# Altium project CRIB.PrjPcb (part 1 of 2)
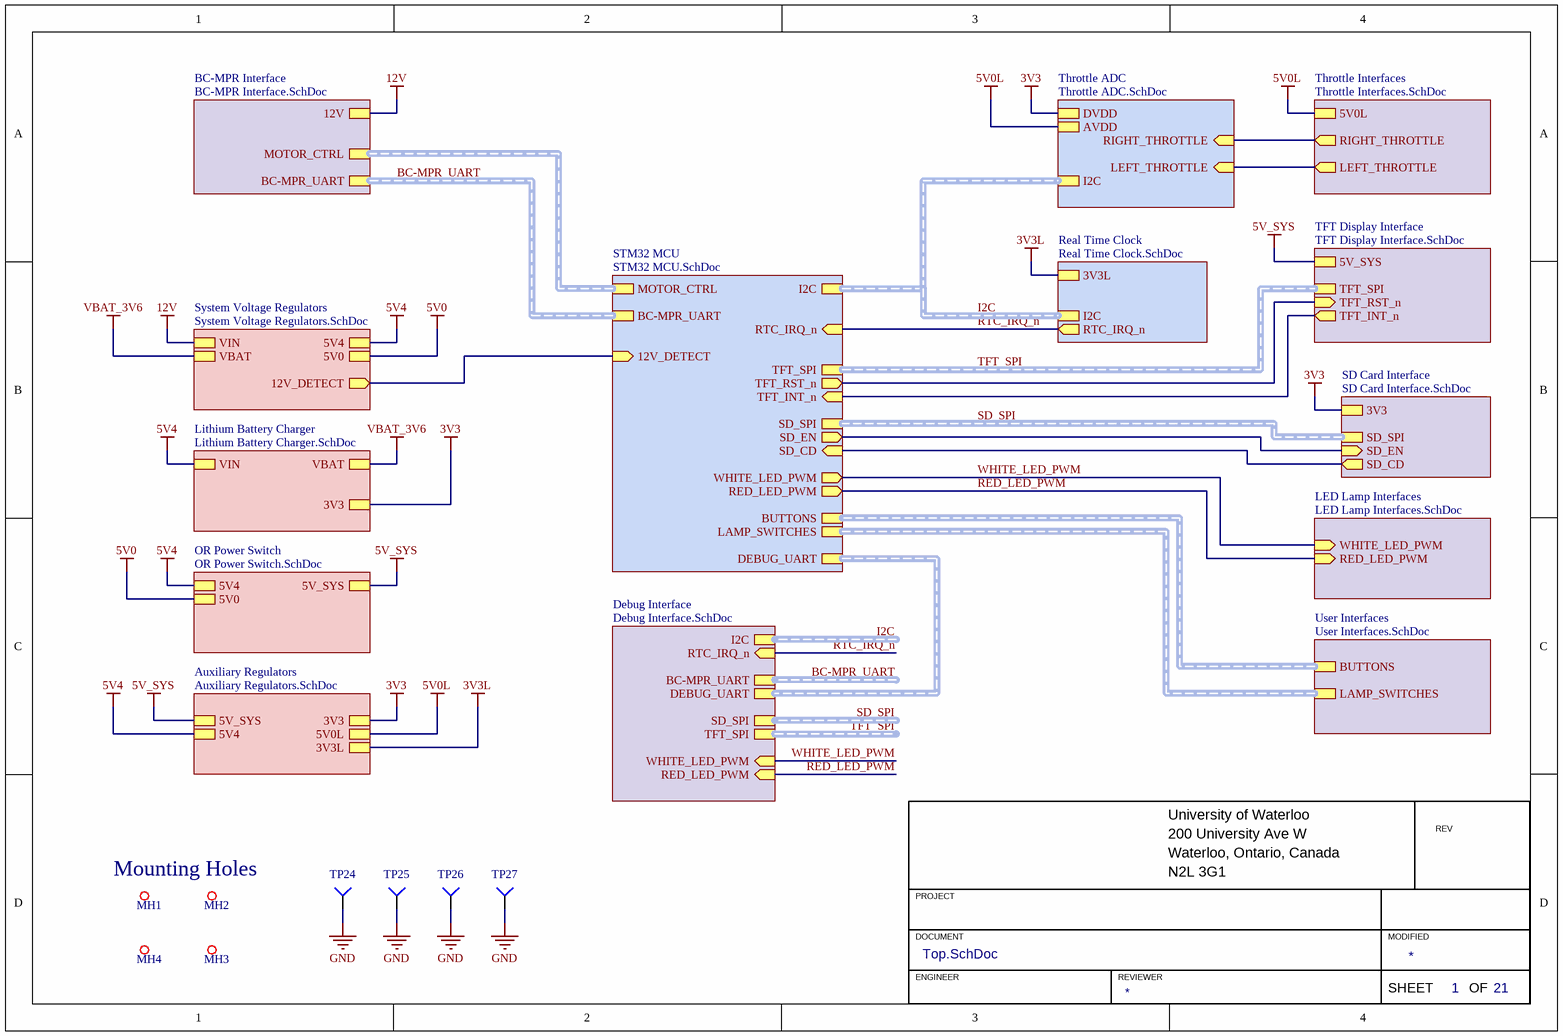
[diagram p0: Top.SchDoc]
21 sheets, 249 parts. Net scope: hierarchical (ports join the sheet entries above them; power ports are global).
Board file: CRIB.PcbDoc
Sheets:
  Top.SchDoc
    STM32 MCU = STM32 MCU.SchDoc
      MCU Power, Clock, & Debug = MCU Power Clock Debug.SchDoc
    TFT Display Interface = TFT Display Interface.SchDoc
    System Voltage Regulators = System Voltage Regulators.SchDoc
      Lithium Battery UVP Switch = Lithium Battery UVP Switch.SchDoc
    Lithium Battery Charger = Lithium Battery Charger.SchDoc
    BC-MPR Interface = BC-MPR Interface.SchDoc
    OR Power Switch = OR Power Switch.SchDoc
    Auxiliary Regulators = Auxiliary Regulators.SchDoc
    Throttle ADC = Throttle ADC.SchDoc
    Throttle Interfaces = Throttle Interfaces.SchDoc
    Real Time Clock = Real Time Clock.SchDoc
      I2C Buffer = I2C Buffer.SchDoc
    SD Card Interface = SD Card Interface.SchDoc
      PMOS Load Switch = PMOS Load Switch.SchDoc
    LED Lamp Interfaces = LED Lamp Interfaces.SchDoc
      Rear LED Driver = CC LED Driver.SchDoc
      Front LED Driver = CC LED Driver.SchDoc
    User Interfaces = User Interfaces.SchDoc
      Up Button Debounce = Debounce Filter.SchDoc
      Down Button Debounce = Debounce Filter.SchDoc
      Left Button Debounce = Debounce Filter.SchDoc
      Right Button Debounce = Debounce Filter.SchDoc
      Centre Button Debounce = Debounce Filter.SchDoc
      White Lamp Switch Debounce = Debounce Filter.SchDoc
      Red Lamp Switch Debounce = Debounce Filter.SchDoc
    Debug Interface = Debug Interface.SchDoc

## Sheet Top.SchDoc
size A4; Organization: TESLA Motors, INC; Address1: 3500 Deer Creek Road; Address2: Palo Alto, CA; Address4: U.S.A.; SheetNumber: 1; SheetTotal: 21

### Parts
MH1  MOUNTING_HOLE_M3  [MOUNTING_HOLE_3mm]  (value not drawn)  (no BOM)
MH2  MOUNTING_HOLE_M3  [MOUNTING_HOLE_3mm]  (value not drawn)  (no BOM)
MH3  MOUNTING_HOLE_M3  [MOUNTING_HOLE_3mm]  (value not drawn)  (no BOM)
MH4  MOUNTING_HOLE_M3  [MOUNTING_HOLE_3mm]  (value not drawn)  (no BOM)
TP24  TESTPOINT_KEYSTONE_LOOP  [KEYSTONE_5019]  (value not drawn)
TP25  TESTPOINT_KEYSTONE_LOOP  [KEYSTONE_5019]  (value not drawn)
TP26  TESTPOINT_KEYSTONE_LOOP  [KEYSTONE_5019]  (value not drawn)
TP27  TESTPOINT_KEYSTONE_LOOP  [KEYSTONE_5019]  (value not drawn)

### Sub-sheets
Auxiliary Regulators = Auxiliary Regulators.SchDoc: 5V_SYS, 3V3, 5V0L, 5V4, 3V3L
BC-MPR Interface = BC-MPR Interface.SchDoc: BC-MPR_UART (harness UART), MOTOR_CTRL (harness MOTOR CTRL), 12V
Debug Interface = Debug Interface.SchDoc: I2C (harness I2C), RTC_IRQ_n (in), BC-MPR_UART (harness UART), DEBUG_UART (harness UART), SD_SPI (harness SPI), TFT_SPI (harness SPI), WHITE_LED_PWM (in), RED_LED_PWM (in)
LED Lamp Interfaces = LED Lamp Interfaces.SchDoc: WHITE_LED_PWM (in), RED_LED_PWM (in)
Lithium Battery Charger = Lithium Battery Charger.SchDoc: VIN, VBAT, 3V3
OR Power Switch = OR Power Switch.SchDoc: 5V4, 5V0, 5V_SYS
Real Time Clock = Real Time Clock.SchDoc: I2C (harness I2C), 3V3L, RTC_IRQ_n (out)
SD Card Interface = SD Card Interface.SchDoc: SD_SPI (harness SPI), 3V3, SD_CD (out), SD_EN (in)
STM32 MCU = STM32 MCU.SchDoc: I2C (harness I2C), BC-MPR_UART (harness UART), MOTOR_CTRL (harness MOTOR CTRL), TFT_SPI (harness SPI), RTC_IRQ_n (in), SD_SPI (harness SPI), SD_CD (in), 12V_DETECT (in), WHITE_LED_PWM (out), RED_LED_PWM (out), DEBUG_UART (harness UART), TFT_RST_n (out), SD_EN (out), BUTTONS (harness BUTTONS), LAMP_SWITCHES (harness LAMP SWITCHES), TFT_INT_n (in)
System Voltage Regulators = System Voltage Regulators.SchDoc: VIN, 5V0, 5V4, VBAT, 12V_DETECT (out)
TFT Display Interface = TFT Display Interface.SchDoc: TFT_SPI (harness SPI), 5V_SYS, TFT_RST_n (in), TFT_INT_n (out)
Throttle ADC = Throttle ADC.SchDoc: I2C (harness I2C), DVDD, AVDD, RIGHT_THROTTLE (in), LEFT_THROTTLE (in)
Throttle Interfaces = Throttle Interfaces.SchDoc: RIGHT_THROTTLE (out), LEFT_THROTTLE (out), 5V0L
User Interfaces = User Interfaces.SchDoc: BUTTONS (harness BUTTONS), LAMP_SWITCHES (harness LAMP SWITCHES)

### Nets
3V3: sheet Lithium Battery Charger/3V3, sheet Auxiliary Regulators/3V3, sheet Throttle ADC/DVDD, sheet SD Card Interface/3V3
3V3L: sheet Auxiliary Regulators/3V3L, sheet Real Time Clock/3V3L
5V0: sheet System Voltage Regulators/5V0, sheet OR Power Switch/5V0
5V0L: sheet Auxiliary Regulators/5V0L, sheet Throttle ADC/AVDD, sheet Throttle Interfaces/5V0L
5V4: sheet System Voltage Regulators/5V4, sheet Lithium Battery Charger/VIN, sheet OR Power Switch/5V4, sheet Auxiliary Regulators/5V4
5V_SYS: sheet TFT Display Interface/5V_SYS, sheet OR Power Switch/5V_SYS, sheet Auxiliary Regulators/5V_SYS
12V: sheet System Voltage Regulators/VIN, sheet BC-MPR Interface/12V
GND: TP24.1(=value) TP25.1(=value) TP26.1(=value) TP27.1(=value)
VBAT_3V6: sheet System Voltage Regulators/VBAT, sheet Lithium Battery Charger/VBAT
12V_DETECT: sheet STM32 MCU/12V_DETECT, sheet System Voltage Regulators/12V_DETECT
LEFT_THROTTLE: sheet Throttle ADC/LEFT_THROTTLE, sheet Throttle Interfaces/LEFT_THROTTLE
RED_LED_PWM: sheet STM32 MCU/RED_LED_PWM, sheet LED Lamp Interfaces/RED_LED_PWM, sheet Debug Interface/RED_LED_PWM
RIGHT_THROTTLE: sheet Throttle ADC/RIGHT_THROTTLE, sheet Throttle Interfaces/RIGHT_THROTTLE
RTC_IRQ_n: sheet STM32 MCU/RTC_IRQ_n, sheet Real Time Clock/RTC_IRQ_n, sheet Debug Interface/RTC_IRQ_n
SD_CD: sheet STM32 MCU/SD_CD, sheet SD Card Interface/SD_CD
SD_EN: sheet STM32 MCU/SD_EN, sheet SD Card Interface/SD_EN
TFT_INT_n: sheet STM32 MCU/TFT_INT_n, sheet TFT Display Interface/TFT_INT_n
TFT_RST_n: sheet STM32 MCU/TFT_RST_n, sheet TFT Display Interface/TFT_RST_n
WHITE_LED_PWM: sheet STM32 MCU/WHITE_LED_PWM, sheet LED Lamp Interfaces/WHITE_LED_PWM, sheet Debug Interface/WHITE_LED_PWM

### Buses and harness runs
harness BC-MPR_UART = sheet BC-MPR Interface/BC-MPR_UART = sheet STM32 MCU/BC-MPR_UART
harness BC-MPR_UART = sheet Debug Interface/BC-MPR_UART
harness I2C = sheet Debug Interface/I2C
harness I2C = sheet Real Time Clock/I2C = sheet STM32 MCU/I2C = sheet Throttle ADC/I2C
harness SD_SPI = sheet Debug Interface/SD_SPI
harness SD_SPI = sheet SD Card Interface/SD_SPI = sheet STM32 MCU/SD_SPI
harness sheet BC-MPR Interface/MOTOR_CTRL = sheet STM32 MCU/MOTOR_CTRL
harness sheet Debug Interface/DEBUG_UART = sheet STM32 MCU/DEBUG_UART
harness sheet STM32 MCU/BUTTONS = sheet User Interfaces/BUTTONS
harness sheet STM32 MCU/LAMP_SWITCHES = sheet User Interfaces/LAMP_SWITCHES
harness TFT_SPI = sheet Debug Interface/TFT_SPI
harness TFT_SPI = sheet STM32 MCU/TFT_SPI = sheet TFT Display Interface/TFT_SPI

### Notes on the sheet
- University of Waterloo
- 200 University Ave W
- REV
- Mounting Holes
- PROJECT
- Waterloo, Ontario, Canada
- N2L 3G1
- DOCUMENT
- ENGINEER
- REVIEWER
- MODIFIED
- SHEET
- OF

### Library data of the parts
TP24-TP27 = TESTPOINT_KEYSTONE_LOOP: PC TEST POINT MINIATURE; Manufacturer 1: Keystone Electronics; Manufacturer Part Number 1: 5019; Package/Footprint: SMD; Supplier 1: Digi-Key; Mounting Type: SMD; Supplier Part Number 1: 36-5019CT-ND

## Sheet STM32 MCU.SchDoc
size A4; Organization: TESLA Motors, INC; Address1: 3500 Deer Creek Road; Address2: Palo Alto, CA; Address4: U.S.A.; SheetNumber: 2; SheetTotal: 21
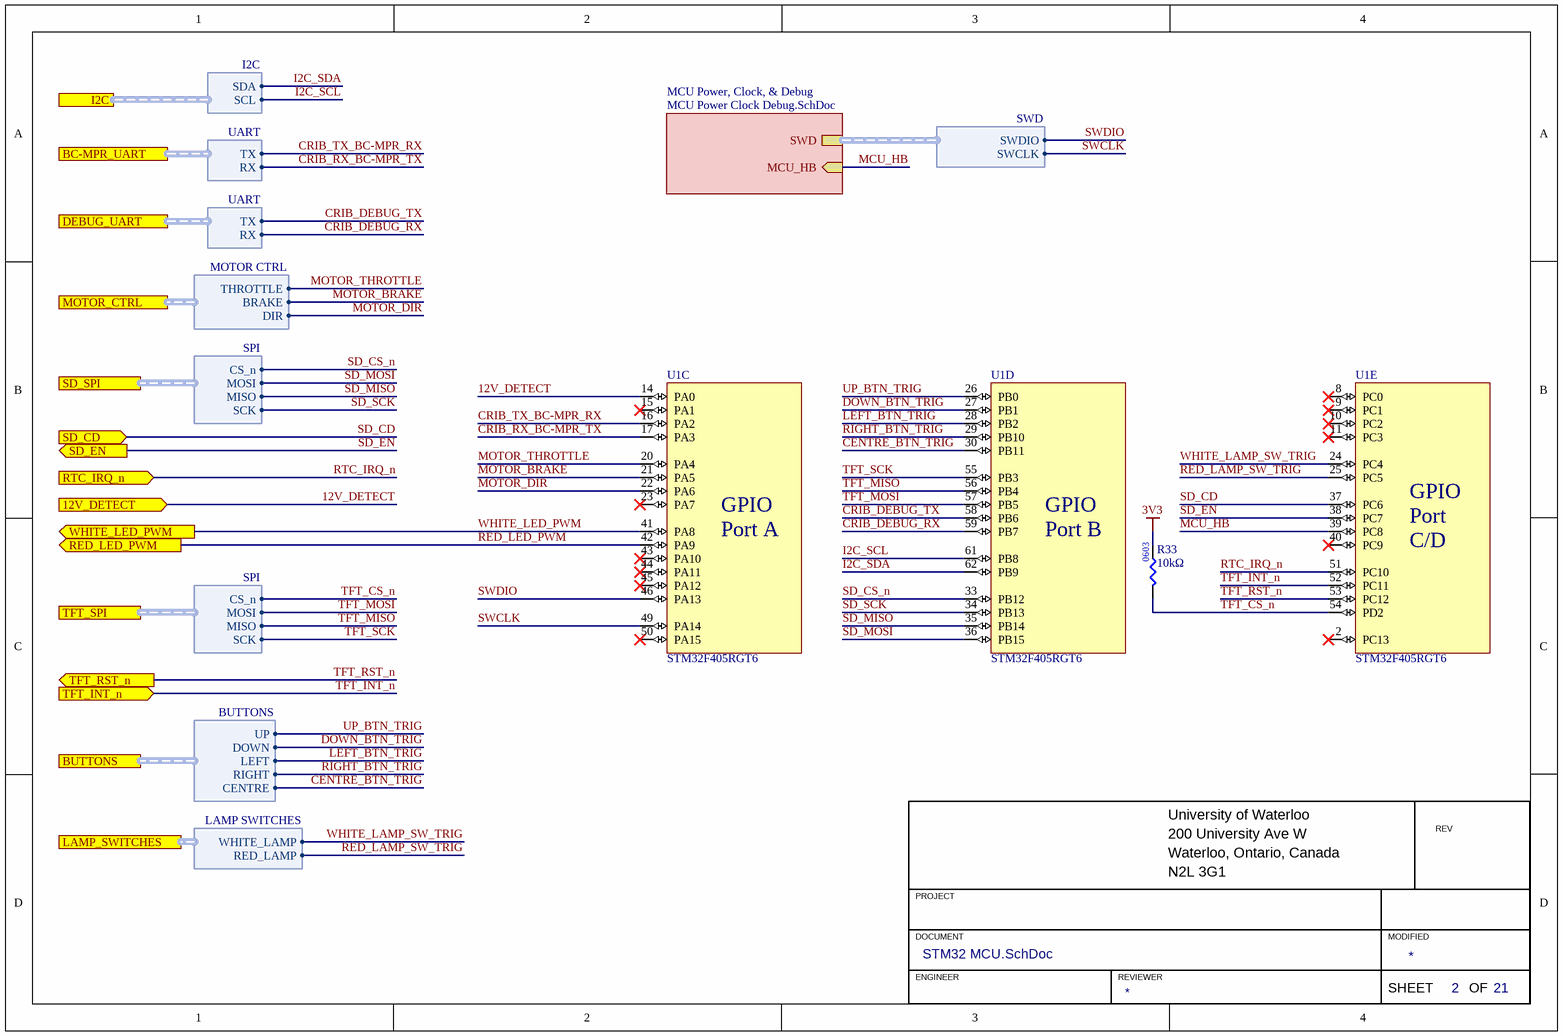
[diagram p1: STM32 MCU.SchDoc]

### Parts
R33  value 10kΩ  [RES0603]  (hidden comment: RES_10kΩ_0603_1%)
U1  STM32F405RGT6  [STM_LQFP64]  (parts C,D,E of 5)

### Sub-sheets
MCU Power, Clock, & Debug = MCU Power Clock Debug.SchDoc: SWD (harness SWD), MCU_HB (in)

### Ports
12V_DETECT (in), BC-MPR_UART (harness UART), BUTTONS (harness BUTTONS), DEBUG_UART (harness UART), I2C (harness I2C), LAMP_SWITCHES (harness LAMP SWITCHES), MOTOR_CTRL (harness MOTOR CTRL), RED_LED_PWM (out), RTC_IRQ_n (in), SD_CD (in), SD_EN (out), SD_SPI (harness SPI), TFT_INT_n (in), TFT_RST_n (out), TFT_SPI (harness SPI), WHITE_LED_PWM (out)

### Harnesses
SWD: SWDIO, SWCLK
I2C: SDA, SCL
UART: TX, RX
MOTOR CTRL: THROTTLE, BRAKE, DIR
SPI: CS_n, MOSI, MISO, SCK
BUTTONS: UP, DOWN, LEFT, RIGHT, CENTRE
LAMP SWITCHES: WHITE_LAMP, RED_LAMP

### Nets
3V3: R33.2
12V_DETECT: U1.14(PA0) ; port 12V_DETECT
CENTRE_BTN_TRIG: U1.30(PB11) ; port BUTTONS.CENTRE
CRIB_DEBUG_RX: U1.59(PB7) ; port DEBUG_UART.RX
CRIB_DEBUG_TX: U1.58(PB6) ; port DEBUG_UART.TX
CRIB_RX_BC-MPR_TX: U1.17(PA3) ; port BC-MPR_UART.RX  [project net BC-MPR_UART.RX]
CRIB_TX_BC-MPR_RX: U1.16(PA2) ; port BC-MPR_UART.TX  [project net BC-MPR_UART.TX]
DOWN_BTN_TRIG: U1.27(PB1) ; port BUTTONS.DOWN
I2C_SCL: U1.61(PB8) ; port I2C.SCL  [project net I2C.SCL]
I2C_SDA: U1.62(PB9) ; port I2C.SDA  [project net I2C.SDA]
LEFT_BTN_TRIG: U1.28(PB2) ; port BUTTONS.LEFT
MCU_HB: U1.39(PC8) ; sheet MCU Power, Clock, & Debug/MCU_HB
MOTOR_BRAKE: U1.21(PA5) ; port MOTOR_CTRL.BRAKE
MOTOR_DIR: U1.22(PA6) ; port MOTOR_CTRL.DIR
MOTOR_THROTTLE: U1.20(PA4) ; port MOTOR_CTRL.THROTTLE
RED_LAMP_SW_TRIG: U1.25(PC5) ; port LAMP_SWITCHES.RED_LAMP
RED_LED_PWM: U1.42(PA9) ; port RED_LED_PWM
RIGHT_BTN_TRIG: U1.29(PB10) ; port BUTTONS.RIGHT
RTC_IRQ_n: U1.51(PC10) ; port RTC_IRQ_n
SD_CD: U1.37(PC6) ; port SD_CD
SD_CS_n: U1.33(PB12) ; port SD_SPI.CS_n
SD_EN: U1.38(PC7) ; port SD_EN
SD_MISO: U1.35(PB14) ; port SD_SPI.MISO
SD_MOSI: U1.36(PB15) ; port SD_SPI.MOSI
SD_SCK: U1.34(PB13) ; port SD_SPI.SCK
SWCLK: U1.49(PA14) ; sheet MCU Power, Clock, & Debug/SWD.SWCLK
SWDIO: U1.46(PA13) ; sheet MCU Power, Clock, & Debug/SWD.SWDIO
TFT_CS_n: R33.1 U1.54(PD2) ; port TFT_SPI.CS_n
TFT_INT_n: U1.52(PC11) ; port TFT_INT_n
TFT_MISO: U1.56(PB4) ; port TFT_SPI.MISO
TFT_MOSI: U1.57(PB5) ; port TFT_SPI.MOSI
TFT_RST_n: U1.53(PC12) ; port TFT_RST_n
TFT_SCK: U1.55(PB3) ; port TFT_SPI.SCK
UP_BTN_TRIG: U1.26(PB0) ; port BUTTONS.UP
WHITE_LAMP_SW_TRIG: U1.24(PC4) ; port LAMP_SWITCHES.WHITE_LAMP
WHITE_LED_PWM: U1.41(PA8) ; port WHITE_LED_PWM

Not connected (* = marked no-connect by the designer): U1 2(PC13)* 8(PC0)* 9(PC1)* 10(PC2)* 11(PC3)* 15(PA1)* 23(PA7)* 40(PC9)* 43(PA10)* 44(PA11)* 45(PA12)* 50(PA15)*

### Notes on the sheet
- University of Waterloo
- 200 University Ave W
- REV
- PROJECT
- Waterloo, Ontario, Canada
- N2L 3G1
- DOCUMENT
- ENGINEER
- REVIEWER
- MODIFIED
- SHEET
- OF
- (in symbol STM32F405RGT6, part C) GPIO / Port A
- (in symbol STM32F405RGT6, part D) GPIO / Port B
- (in symbol STM32F405RGT6, part E) GPIO / Port C/D

### Library data of the parts
R33 = RES_10kΩ_0603_1%: RES 10K OHM 1% 1/8W 0603; Manufacturer 1: Stackpole Electronics Inc; Manufacturer Part Number 1: RNCP0603FTD10K0; Supplier Part Number 1: RNCP0603FTD10K0CT-ND; Supplier 1: Digi-Key; Mounting Type: SMD; Package: 0603
U1 = STM32F405RGT6: IC MCU 32BIT 1MB FLASH 64LQFP; Manufacturer 1: STMicroelectronics; Package/Footprint: 64-LQFP; Manufacturer Part Number 1: STM32F405RGT6; Supplier 1: Digi-Key; Supplier Part Number 1: 497-11767-ND

## Sheet MCU Power Clock Debug.SchDoc
size A4; Organization: TESLA Motors, INC; Address1: 3500 Deer Creek Road; Address2: Palo Alto, CA; Address4: U.S.A.; SheetNumber: 3; SheetTotal: 21
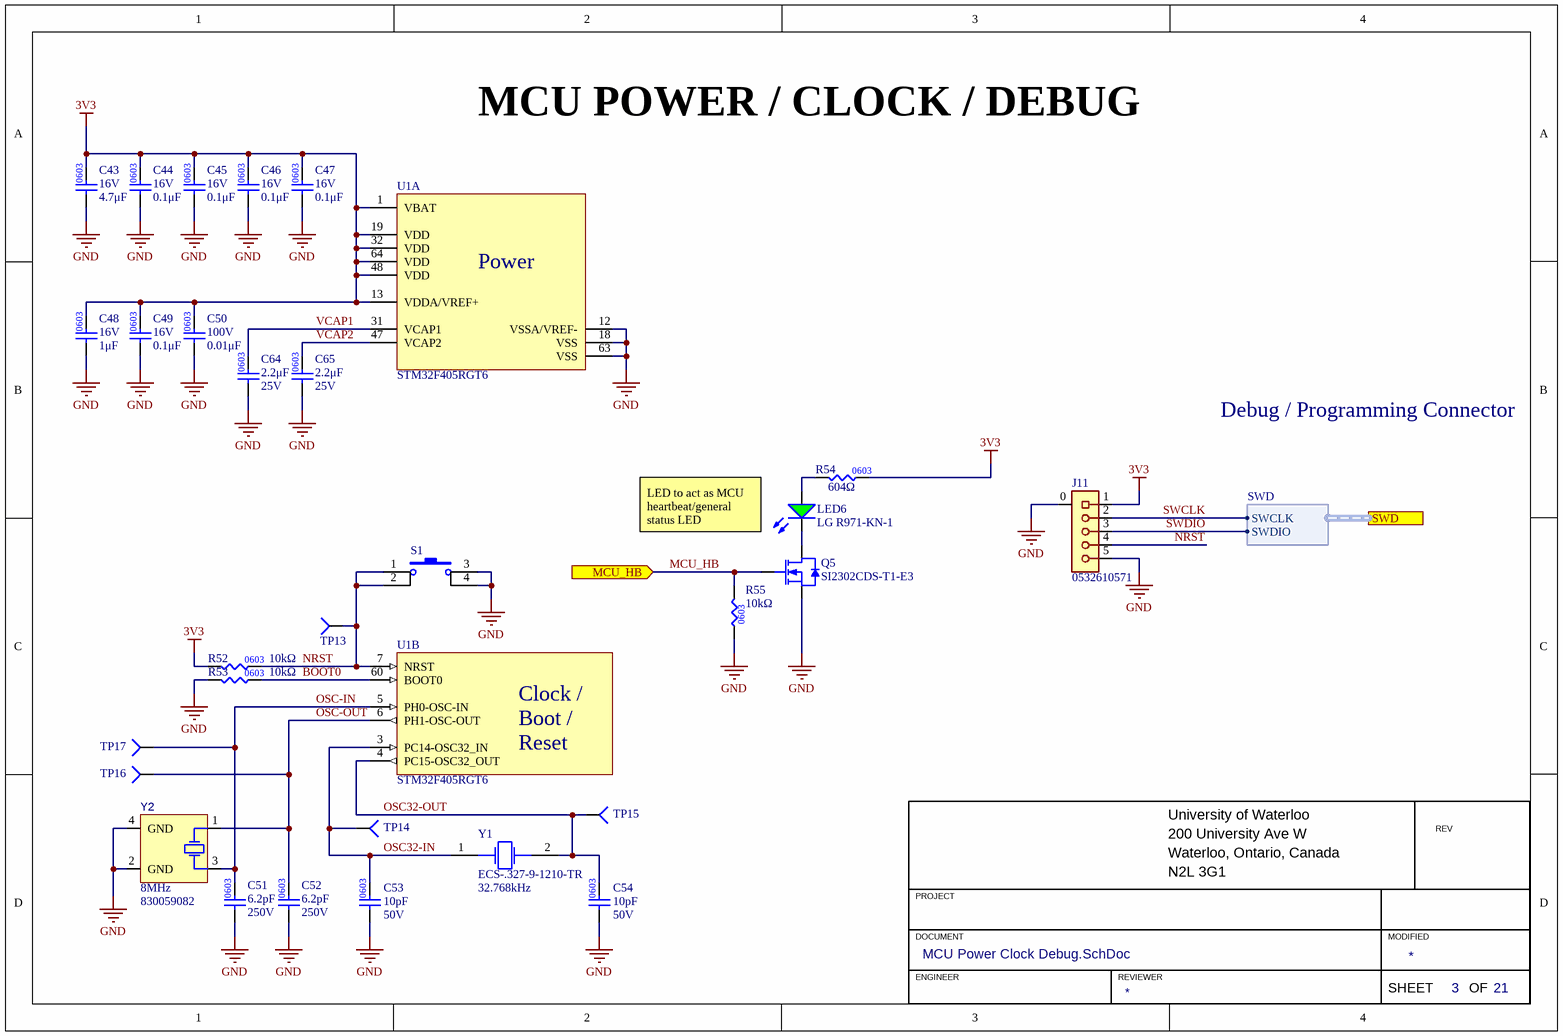
[diagram p2: MCU Power Clock Debug.SchDoc]

### Parts
C43  value 4.7μF  Voltage Rating: 16V  [CAP0603]  (hidden comment: CAP_4.7uF_16V_0603)
C44  value 0.1μF  Voltage Rating: 16V  [CAP0603]  (hidden comment: CAP_0.1uF_16V_0603)
C45  value 0.1μF  Voltage Rating: 16V  [CAP0603]  (hidden comment: CAP_0.1uF_16V_0603)
C46  value 0.1μF  Voltage Rating: 16V  [CAP0603]  (hidden comment: CAP_0.1uF_16V_0603)
C47  value 0.1μF  Voltage Rating: 16V  [CAP0603]  (hidden comment: CAP_0.1uF_16V_0603)
C48  value 1μF  Voltage Rating: 16V  [CAP0603]  (hidden comment: CAP_1uF_16V_0603)
C49  value 0.1μF  Voltage Rating: 16V  [CAP0603]  (hidden comment: CAP_0.1uF_16V_0603)
C50  value 0.01μF  Voltage Rating: 100V  [CAP0603]  (hidden comment: CAP_0.01uF_100V_0603)
C51  value 6.2pF  Voltage Rating: 250V  [CAP0603]  (hidden comment: CAP_6.2pF_250V_0603)
C52  value 6.2pF  Voltage Rating: 250V  [CAP0603]  (hidden comment: CAP_6.2pF_250V_0603)
C53  value 10pF  Voltage Rating: 50V  [CAP0603]  (hidden comment: CAP_10pF_50V_0603)
C54  value 10pF  Voltage Rating: 50V  [CAP0603]  (hidden comment: CAP_10pF_50V_0603)
C64  value 2.2μF  Voltage Rating: 25V  [CAP0603]  (hidden comment: CAP_2.2uF_25V_0603)
C65  value 2.2μF  Voltage Rating: 25V  [CAP0603]  (hidden comment: CAP_2.2uF_25V_0603)
J11  Manufacturer Part Number 1: 0532610571  [MOLEX-532610571]  (hidden comment: CON_MOLEX-PICO_5POS_RA)
LED6  Manufacturer Part Number 1: LG R971-KN-1  [LED_0805_GREEN]  (hidden comment: LED_GREEN)
Q5  Manufacturer Part Number 1: SI2302CDS-T1-E3  [SOT23-3]  (hidden comment: NMOS_20V_6A)
R52  value 10kΩ  [RES0603]  (hidden comment: RES_10kΩ_0603_1%)
R53  value 10kΩ  [RES0603]  (hidden comment: RES_10kΩ_0603_1%)
R54  value 604Ω  [RES0603]  (hidden comment: RES_604Ω_0603_1%)
R55  value 10kΩ  [RES0603]  (hidden comment: RES_10kΩ_0603_1%)
S1  SW_SPST_NO_4.5x4.5  [SPST_PUSHBUTTON_TL3305AF260QG]  (value not drawn)
TP13  TESTPOINT_1MM_CIRCLE  [TESTPOINT_CIRCLE_1MM]  (value not drawn)  (no BOM)
TP14  TESTPOINT_1MM_CIRCLE  [TESTPOINT_CIRCLE_1MM]  (value not drawn)  (no BOM)
TP15  TESTPOINT_1MM_CIRCLE  [TESTPOINT_CIRCLE_1MM]  (value not drawn)  (no BOM)
TP16  TESTPOINT_1MM_CIRCLE  [TESTPOINT_CIRCLE_1MM]  (value not drawn)  (no BOM)
TP17  TESTPOINT_1MM_CIRCLE  [TESTPOINT_CIRCLE_1MM]  (value not drawn)  (no BOM)
U1  STM32F405RGT6  [STM_LQFP64]  (parts A,B of 5)
Y1  Frequency: 32.768kHz  Manufacturer Part Number 1: ECS-.327-9-1210-TR  [OSC_ECS-327TR-2]  (hidden comment: CRYSTAL_32.768KHZ)
Y2  Frequency: 8MHz  Manufacturer Part Number 1: 830059082  [XTAL_WURTH_830059082]  (hidden comment: CRYSTAL_8MHZ_8PF)

### Ports
MCU_HB (in), SWD (harness SWD)

### Harnesses
SWD: SWDIO, SWCLK

### Nets
3V3: C43.2 C44.2 C45.2 C46.2 C47.2 C48.2 C49.2 C50.2 J11.1 R52.1 R54.2 U1.1(VBAT) U1.13(VDDA/VREF+) U1.19(VDD) U1.32(VDD) U1.48(VDD) U1.64(VDD)
GND: C43.1 C44.1 C45.1 C46.1 C47.1 C48.1 C49.1 C50.1 C51.1 C52.1 C53.1 C54.1 C64.1 C65.1 J11.0 J11.5 Q5.2(SOURCE) R53.1 R55.1 S1.3 S1.4 U1.12(VSSA/VREF-) U1.18(VSS) U1.63(VSS) Y2.2(GND) Y2.4(GND)
BOOT0: R53.2 U1.60(BOOT0)
MCU_HB: Q5.1(GATE) R55.2 ; port MCU_HB
NRST: J11.4 R52.2 S1.1 S1.2 TP13.1(=value) U1.7(NRST)
OSC32-IN: C53.2 TP14.1(=value) U1.3(PC14-OSC32_IN) Y1.1
OSC32-OUT: C54.2 TP15.1(=value) U1.4(PC15-OSC32_OUT) Y1.2
OSC-IN: C51.2 TP17.1(=value) U1.5(PH0-OSC-IN) Y2.3(HOT)
OSC-OUT: C52.2 TP16.1(=value) U1.6(PH1-OSC-OUT) Y2.1(HOT)
SWCLK: J11.2 ; port SWD.SWCLK
SWDIO: J11.3 ; port SWD.SWDIO
VCAP1: C64.2 U1.31(VCAP1)
VCAP2: C65.2 U1.47(VCAP2)
NetLED6_1: LED6.1(A) R54.1
NetLED6_2: LED6.2(K) Q5.3(DRAIN)

### Notes on the sheet
- MCU POWER / CLOCK / DEBUG
- Debug / Programming Connector
- LED to act as MCU heartbeat/general status LED
- University of Waterloo
- 200 University Ave W
- REV
- PROJECT
- Waterloo, Ontario, Canada
- N2L 3G1
- DOCUMENT
- ENGINEER
- REVIEWER
- MODIFIED
- SHEET
- OF
- (in symbol CAP_0.01uF_100V_0603) 0603
- (in symbol CAP_2.2uF_25V_0603) 0603
- (in symbol RES_604Ω_0603_1%) 0603
- (in symbol STM32F405RGT6, part A) Power
- (in symbol STM32F405RGT6, part B) Clock / / Boot / / Reset

### Library data of the parts
C43 = CAP_4.7uF_16V_0603: CAP CER 4.7UF 16V X6S 0603; Manufacturer Part Number 1: GRM188C81C475KE11D; Manufacturer 1: Murata Electronics; Supplier Part Number 1: 490-13362-1-ND; Supplier 1: Digi-Key; Mounting Type: SMD; Package: 0603; Dielectric: X6S
C44-C47 C49 = CAP_0.1uF_16V_0603: CAP CER 0.1UF 16V X7R 0603; Manufacturer Part Number 1: CC0603KRX7R7BB104; Manufacturer 1: Yageo; Package: 0603; Supplier Part Number 1: 311-1088-1-ND; Supplier 1: Digi-Key; Dielectric: X7R
C48 = CAP_1uF_16V_0603: CAP CER 1UF 16V X7R 0603; Manufacturer 1: Yageo; Manufacturer Part Number 1: CC0603KPX7R7BB105; Supplier Part Number 1: 13-CC0603KPX7R7BB105CT-ND; Supplier 1: Digi-Key; Mounting Type: SMD; Package: 0603; Dielectric: X7R
C50 = CAP_0.01uF_100V_0603: CAP CER 0.01uF 100V X7R 0603; Manufacturer Part Number 1: GCM188R72A103KA37J; Manufacturer 1: Murata Electronics; Supplier Part Number 1: 490-8028-1-ND; Supplier 1: Digi-Key; Dielectric: X7R
C51 C52 = CAP_6.2pF_250V_0603: HVCAP0603 COG 6.2PF .25PF 250V; Manufacturer Part Number 1: CHV0603N2506R2CCT; Manufacturer 1: Cal-Chip Electronics, Inc.; Dielectric: C0G, NP0; Supplier Part Number 1: 4713-CHV0603N2506R2CCT-ND; Supplier 1: Digi-Key; Mounting Type: SMD; Package: 0603
C53 C54 = CAP_10pF_50V_0603: CAP CER 10PF 50V X7R 0603; Manufacturer 1: KEMET; Manufacturer Part Number 1: C0603C100J5RAC7867; Package: 0603; Supplier 1: Digi-Key; Supplier Part Number 1: 399-C0603C100J5RAC7867CT-ND
C64 C65 = CAP_2.2uF_25V_0603: CAP CER 2.2UF 25V X5R 0603; Manufacturer Part Number 1: C1608X5R1E225K080AB; Manufacturer 1: TDK Corporation; Dielectric: 5; Supplier Part Number 1: 445-5964-1-ND; Supplier 1: Digi-Key
J11 = CON_MOLEX-PICO_5POS_RA: CONN HEADER SMD R/A 5POS 1.25MM; Manufacturer 1: Molex; Supplier 1: Digi-Key; Supplier Part Number 1: WM7623CT-ND
LED6 = LED_GREEN: LED GREEN DIFFUSED 0805 SMD; Manufacturer 1: OSRAM; Forward Voltage Drop: 2.2V; Package/Footprint: 0805; Supplier Part Number 1: 475-1410-1-ND; Supplier 1: Digi-Key; Mounting Type: SMD
Q5 = NMOS_20V_2.6A: MOSFET N-CH 20V 2.6A SOT23-3; Manufacturer 1: Vishay Siliconix; Package/Footprint: SOT-23-3; Supplier 1: Digi-Key; Supplier Part Number 1: SI2302CDS-T1-E3CT-ND
R52 R53 R55 = RES_10kΩ_0603_1%: as R33 on sheet STM32 MCU; Supplier Part Number 1: RNCP0603FTD10K0CT-ND; Supplier 1: Digi-Key; Mounting Type: SMD; Package: 0603
R54 = RES_604Ω_0603_1%: RES 604 OHM 1% 1/10W 0603; Manufacturer 1: Yageo; Manufacturer Part Number 1: RC0603FR-07604RL; Supplier Part Number 1: 311-604HRCT-ND; Supplier 1: Digi-Key
S1 = SW_SPST_NO_4.5x4.5: SWITCH TACTILE SPST-NO 50MA 12V; Manufacturer Part Number 1: TL3305AF260QG; Manufacturer 1: E-Switch; Mounting Type: SMD; Supplier 1: Digi-Key; Supplier Part Number 1: EG5353CT-ND
TP13-TP17 = TESTPOINT_1MM_CIRCLE: TESTPOINT 1MM CIRCLE
U1 = STM32F405RGT6: as U1 on sheet STM32 MCU; Manufacturer Part Number 1: STM32F405RGT6; Supplier 1: Digi-Key; Supplier Part Number 1: 497-11767-ND
Y1 = CRYSTAL_32.768KHZ: CRYSTAL 32.7680KHZ 9PF SMD; Manufacturer 1: ECS Inc.; Supplier 1: Digi-Key; Supplier Part Number 1: XC2283CT-ND
Y2 = CRYSTAL_8MHZ_8PF: WE-XTAL QUARTZ CRYSTAL 8.0 MHZ;; Manufacturer 1: Kyocera AVX; Package/Footprint: SMD; Load Capacitance: 10pF; Mounting Type: SMD; Supplier 1: Digikey; Supplier Part Number 1: 1923-830059082CT-ND

## Sheet TFT Display Interface.SchDoc
size A4; Organization: TESLA Motors, INC; Address1: 3500 Deer Creek Road; Address2: Palo Alto, CA; Address4: U.S.A.; SheetNumber: 4; SheetTotal: 21
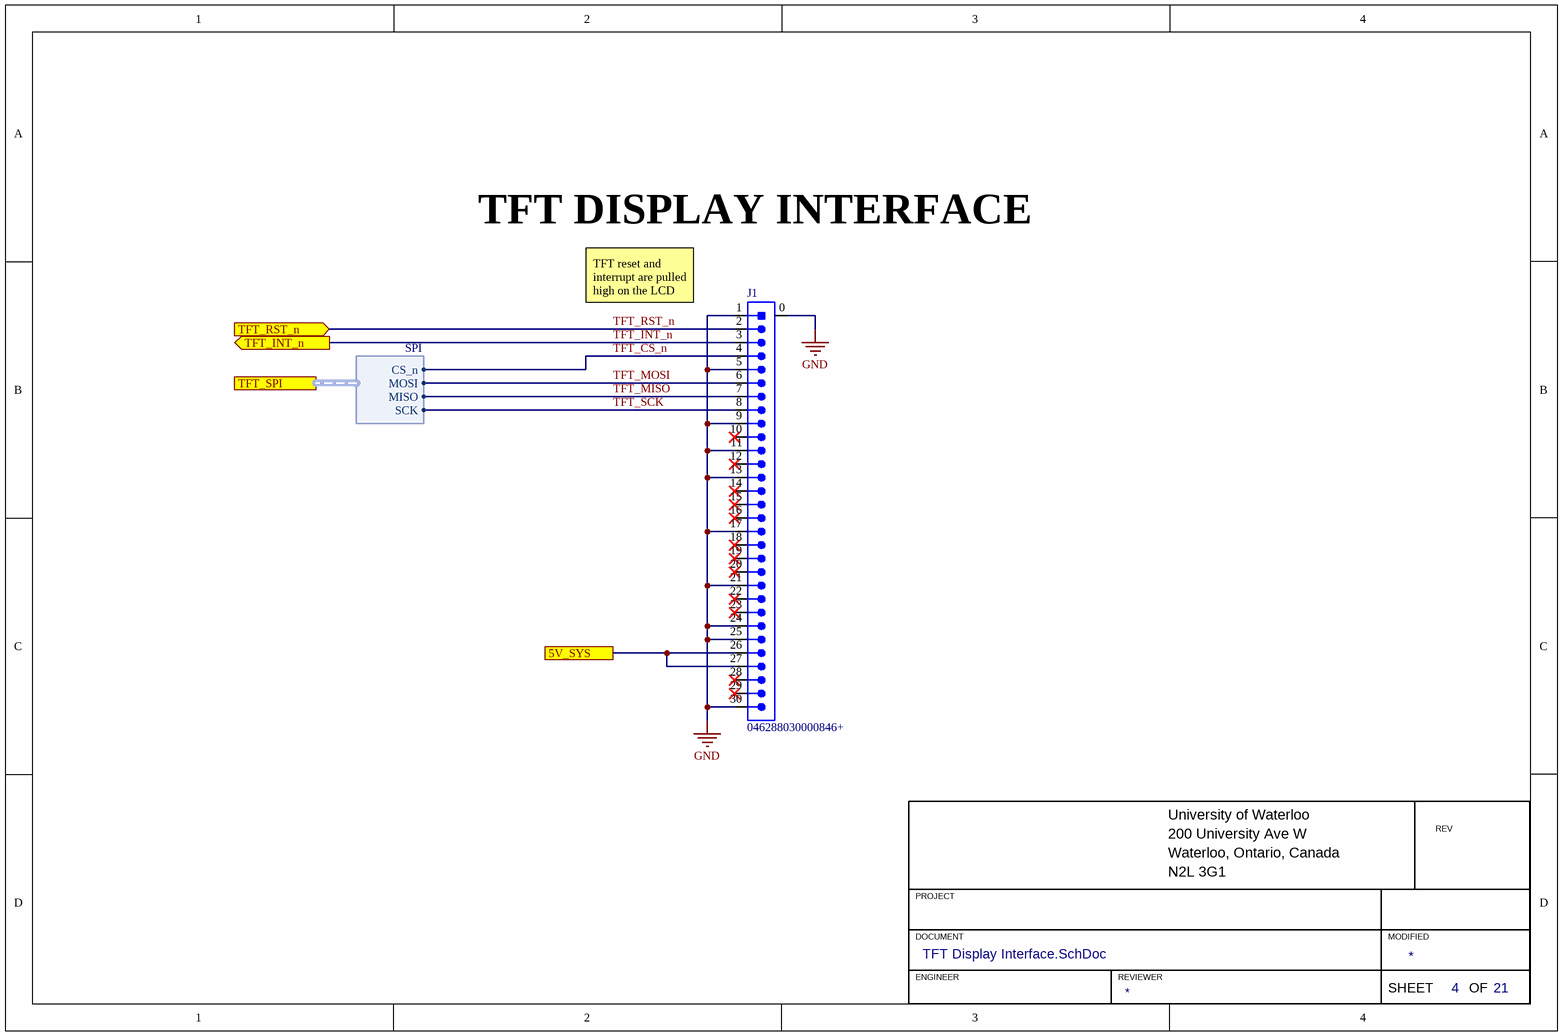
[diagram p3: TFT Display Interface.SchDoc]

### Parts
J1  Manufacturer Part Number 1: 046288030000846+  [MOLEX_FFC_30P_RA]  (hidden comment: CON_MOLEX-FFC_30P_RA)

### Ports
5V_SYS, TFT_INT_n (out), TFT_RST_n (in), TFT_SPI (harness SPI)

### Harnesses
SPI: CS_n, MOSI, MISO, SCK

### Nets
5V_SYS: J1.26 J1.27 ; port 5V_SYS
GND: J1.0 J1.1 J1.5 J1.9 J1.11 J1.13 J1.17 J1.21 J1.24 J1.25 J1.30
TFT_CS_n: J1.4 ; port TFT_SPI.CS_n
TFT_INT_n: J1.3 ; port TFT_INT_n
TFT_MISO: J1.7 ; port TFT_SPI.MISO
TFT_MOSI: J1.6 ; port TFT_SPI.MOSI
TFT_RST_n: J1.2 ; port TFT_RST_n
TFT_SCK: J1.8 ; port TFT_SPI.SCK

Not connected (* = marked no-connect by the designer): J1 10* 12* 14* 15* 16* 18* 19* 20* 22* 23* 28* 29*

### Notes on the sheet
- TFT DISPLAY INTERFACE
- TFT reset and interrupt are pulled high on the LCD module
- University of Waterloo
- 200 University Ave W
- REV
- PROJECT
- Waterloo, Ontario, Canada
- N2L 3G1
- DOCUMENT
- ENGINEER
- REVIEWER
- MODIFIED
- SHEET
- OF

### Library data of the parts
J1 = CON_MOLEX-FFC_30P_RA: CONN FFC BOTTOM 30POS 0.5MM R/A; Manufacturer 1: Molex; Package/Footprint: SMD; Current Rating: 0.4A; Voltage Rating: 50V; Supplier 1: Digi-Key; Mounting Type: SMD; Orientation: Right Angle; Pitch: 0.5mm; Supplier Part Number 1: 478-046288030000846+CT-ND

## Sheet System Voltage Regulators.SchDoc
size A4; Organization: TESLA Motors, INC; Address1: 3500 Deer Creek Road; Address2: Palo Alto, CA; Address4: U.S.A.; SheetNumber: 6; SheetTotal: 21
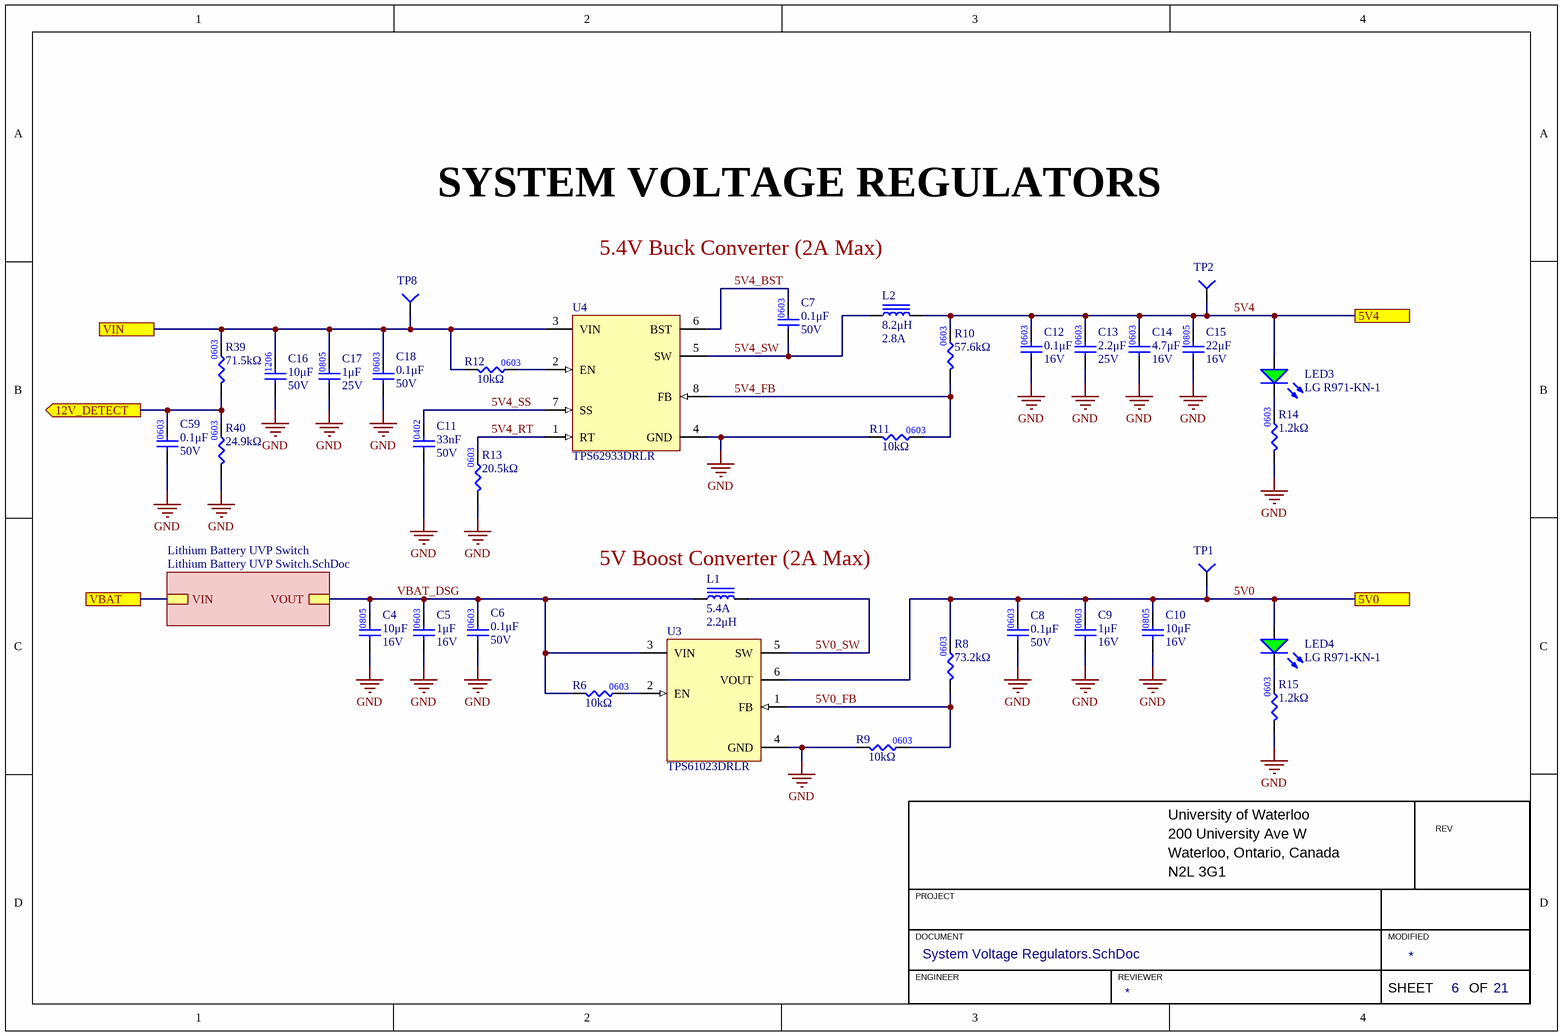
[diagram p4: System Voltage Regulators.SchDoc]

### Parts
C4  value 10μF  Voltage Rating: 16V  [CAP0805]  (hidden comment: CAP_10uF_16V_0805)
C5  value 1μF  Voltage Rating: 16V  [CAP0603]  (hidden comment: CAP_1uF_16V_0603)
C6  value 0.1μF  Voltage Rating: 50V  [CAP0603]  (hidden comment: CAP_0.1uF_50V_0603)
C7  value 0.1μF  Voltage Rating: 50V  [CAP0603]  (hidden comment: CAP_0.1uF_50V_0603)
C8  value 0.1μF  Voltage Rating: 50V  [CAP0603]  (hidden comment: CAP_0.1uF_50V_0603)
C9  value 1μF  Voltage Rating: 16V  [CAP0603]  (hidden comment: CAP_1uF_16V_0603)
C10  value 10μF  Voltage Rating: 16V  [CAP0805]  (hidden comment: CAP_10uF_16V_0805)
C11  Capacitance: 33nF  Rated DC Voltage (URdc): 50V  [CAP0603]  (hidden comment: CAP_0.033uF_50V_X7R_0603)
C12  value 0.1μF  Voltage Rating: 16V  [CAP0603]  (hidden comment: CAP_0.1uF_16V_0603)
C13  value 2.2μF  Voltage Rating: 25V  [CAP0603]  (hidden comment: CAP_2.2uF_25V_0603)
C14  value 4.7μF  Voltage Rating: 16V  [CAP0603]  (hidden comment: CAP_4.7uF_16V_0603)
C15  value 22μF  Voltage Rating: 16V  [CAP0805]  (hidden comment: CAP_22uF_16V_0805)
C16  value 10μF  Voltage Rating: 50V  [CAP1206]  (hidden comment: CAP_10uF_50V_1206)
C17  value 1μF  Voltage Rating: 25V  [CAP0805]  (hidden comment: CAP_1uF_25V_0805)
C18  value 0.1μF  Voltage Rating: 50V  [CAP0603]  (hidden comment: CAP_0.1uF_50V_0603)
C59  value 0.1μF  Voltage Rating: 50V  [CAP0603]  (hidden comment: CAP_0.1uF_50V_0603)
L1  Current Rating: 5.4A  Inductance: 2.2μH  [IND_1210]  (hidden comment: IND_2.2uH_5.4A)
L2  value 8.2μH  Current Rating: 2.8A  [IND_WURTH_1616]  (hidden comment: IND_8.2uH_2.8A)
LED3  Manufacturer Part Number 1: LG R971-KN-1  [LED_0805_GREEN]  (hidden comment: LED_GREEN_0805)
LED4  Manufacturer Part Number 1: LG R971-KN-1  [LED_0805_GREEN]  (hidden comment: LED_GREEN_0805)
R6  value 10kΩ  [RES0603]  (hidden comment: RES_10kΩ_0603_1%)
R8  value 73.2kΩ  [RES0603]  (hidden comment: RES_73.2kΩ_0603_1%)
R9  value 10kΩ  [RES0603]  (hidden comment: RES_10kΩ_0603_1%)
R10  value 57.6kΩ  [RES0603]  (hidden comment: RES_57.6kΩ_0603_1%)
R11  value 10kΩ  [RES0603]  (hidden comment: RES_10kΩ_0603_1%)
R12  value 10kΩ  [RES0603]  (hidden comment: RES_10kΩ_0603_1%)
R13  value 20.5kΩ  [RES0603]  (hidden comment: RES_20.5kΩ_0603_1%)
R14  value 1.2kΩ  [RES0603]  (hidden comment: RES_1.2kΩ_0603_1%)
R15  value 1.2kΩ  [RES0603]  (hidden comment: RES_1.2kΩ_0603_1%)
R39  value 71.5kΩ  [RES0603]  (hidden comment: RES_71.5kΩ_0603_1%)
R40  value 24.9kΩ  [RES0603]  (hidden comment: RES_24.9kΩ_0603_1%)
TP1  TESTPOINT_KEYSTONE_LOOP  [KEYSTONE_5019]  (value not drawn)
TP2  TESTPOINT_KEYSTONE_LOOP  [KEYSTONE_5019]  (value not drawn)
TP8  TESTPOINT_KEYSTONE_LOOP  [KEYSTONE_5019]  (value not drawn)
U3  TPS61023DRLR  [TI_SOT-563]
U4  TPS62933DRLR  [TI_SOT-583]

### Sub-sheets
Lithium Battery UVP Switch = Lithium Battery UVP Switch.SchDoc: VIN, VOUT

### Ports
5V0, 5V4, 12V_DETECT (out), VBAT, VIN

### Nets
5V0: C8.2 C9.2 C10.2 LED4.1(A) R8.2 TP1.1(=value) U3.6(VOUT) ; port 5V0
5V4: C12.2 C13.2 C14.2 C15.2 L2.2 LED3.1(A) R10.2 TP2.1(=value) ; port 5V4
12V: C16.2 C17.2 C18.2 R12.1 R39.2 TP8.1(=value) U4.3(VIN) ; port VIN
GND: C4.1 C5.1 C6.1 C8.1 C9.1 C10.1 C11.1 C12.1 C13.1 C14.1 C15.1 C16.1 C17.1 C18.1 C59.1 R9.1 R11.1 R13.1 R14.1 R15.1 R40.1 U3.4(GND) U4.4(GND)
VBAT_3V6: port VBAT, sheet Lithium Battery UVP Switch/VIN
5V0_FB: R8.1 R9.2 U3.1(FB)
5V0_SW: L1.2 U3.5(SW)
5V4_BST: C7.2 U4.6(BST)
5V4_FB: R10.1 R11.2 U4.8(FB)
5V4_RT: R13.2 U4.1(RT)
5V4_SS: C11.2 U4.7(SS)
5V4_SW: C7.1 L2.1 U4.5(SW)
12V_DETECT: C59.2 R39.1 R40.2 ; port 12V_DETECT
VBAT_DSG: C4.2 C5.2 C6.2 L1.1 R6.1 U3.3(VIN) ; sheet Lithium Battery UVP Switch/VOUT
NetLED3_2: LED3.2(K) R14.2
NetLED4_2: LED4.2(K) R15.2
NetR6_2: R6.2 U3.2(EN)
NetR12_2: R12.2 U4.2(EN)

### Notes on the sheet
- SYSTEM VOLTAGE REGULATORS
- 5.4V Buck Converter (2A Max)
- (near L1) 5V Boost Converter (2A Max)
- University of Waterloo
- 200 University Ave W
- REV
- PROJECT
- Waterloo, Ontario, Canada
- N2L 3G1
- DOCUMENT
- ENGINEER
- REVIEWER
- MODIFIED
- SHEET
- OF
- (in symbol CAP_0.033uF_50V_X7R_0603) 0402
- (in symbol CAP_1uF_25V_0805) 0805
- (in symbol CAP_2.2uF_25V_0603) 0603
- (in symbol RES_20.5kΩ_0603_1%) 0603
- (in symbol RES_24.9kΩ_0603_1%) 0603
- (in symbol RES_73.2kΩ_0603_1%) 0603

### Library data of the parts
C4 C10 = CAP_10uF_16V_0805: CAP CER 10UF 16V X5R 0805; Manufacturer 1: Yageo; Manufacturer Part Number 1: CC0805KKX5R7BB106; Package/Footprint: 0805; Supplier 1: Digi-Key; Supplier Part Number 1: 311-1865-1-ND; Mounting Type: SMD; Dielectric: X5R
C5 C9 = CAP_1uF_16V_0603: as C48 on sheet MCU Power Clock Debug; Supplier 1: Digi-Key; Supplier Part Number 1: 13-CC0603KPX7R7BB105CT-ND; Dielectric: X7R; Mounting Type: SMD; Package: 0603
C6 C7 C18 C59 = CAP_0.1uF_50V_0603: CAP CER 0.1UF 50V X7R 0603; Manufacturer 1: Yageo; Manufacturer Part Number 1: CC0603KRX7R9BB104; Package/Footprint: 0603; Supplier 1: Digi-Key; Supplier Part Number 1: 311-1344-1-ND; Mounting Type: SMD; Dielectric: X7R
C8 = CAP_0.1uF_50V_0603: CAP CER 0.1UF 50V X7R 0603; Manufacturer Part Number 1: CC0603KRX7R9BB104; Manufacturer 1: Yageo; Package/Footprint: 0603; Supplier Part Number 1: 311-1344-1-ND; Supplier 1: Digi-Key; Dielectric: X7R; Mounting Type: SMD
C11 = CAP_0.033uF_50V_X7R_0603: CAP CER 0.033UF 50V X7R 0603; Manufacturer: Samsung Electro-Mechanics; Manufacturer Part Number: CL10B333KB8NFNC; Supplier 1: Digi-Key; Supplier Part Number 1: 1276-2040-1-ND; Mounting Type: Surface Mount; Temperature Characteristics Code: X7R; Package: 0603
C12 = CAP_0.1uF_16V_0603: as C44 on sheet MCU Power Clock Debug; Package: 0603; Supplier Part Number 1: 311-1088-1-ND; Supplier 1: Digi-Key; Dielectric: X7R
C13 = CAP_2.2uF_25V_0603: CAP CER 2.2UF 25V X5R 0603; Manufacturer 1: TDK Corporation; Manufacturer Part Number 1: C1608X5R1E225K080AB; Dielectric: 5; Supplier Part Number 1: 445-5964-1-ND; Supplier 1: Digi-Key
C14 = CAP_4.7uF_16V_0603: as C43 on sheet MCU Power Clock Debug; Supplier Part Number 1: 490-13362-1-ND; Supplier 1: Digi-Key; Mounting Type: SMD; Package: 0603; Dielectric: X6S
C15 = CAP_22uF_16V_0805: CAP CER 22UF 16V X5R 0805; Manufacturer 1: Murata Electronics; Manufacturer Part Number 1: GRM219R61C226ME15L; Package/Footprint: 0805; Mounting Type: SMD; Supplier 1: Digi-Key; Supplier Part Number 1: 490-9952-1-ND; Dielectric: X5R
C16 = CAP_10uF_50V_1206: CAP CER 10UF 50V X5R 1206; Manufacturer 1: Murata; Manufacturer Part Number 1: GRT31CR61H106KE01L; Supplier Part Number 1: 490-12456-1-ND; Supplier 1: Digi-Key; Mounting Type: SMD; Package: 1206; Dielectric: X5R
C17 = CAP_1uF_25V_0805: CAP CER 1UF 25V X7R 0805; Manufacturer 1: Murata; Manufacturer Part Number 1: GCM21BR71E105KA56L; Supplier 1: Digi-Key; Supplier Part Number 1: 490-4785-1-ND; Dielectric: X7R
L1 = IND_2.2uH_5.4A: FIXED IND 2.2UH 5.4A 46MOHM SMD; Manufacturer 1: Vishay Dale; Manufacturer Part Number 1: IHLP1210BZEZ2R2M5A; Supplier 1: Digi-Key; Mounting Type: SMD; DC Resistance (DCR): 46mOhm; Supplier Part Number 1: 541-IHLP1210BZEZ2R2M5ACT-ND
L2 = IND_8.2uH_2.8A: FIXED IND 8.2UH 2.8A 86 MOHM SMD; Manufacturer 1: Würth Elektronik; Manufacturer Part Number 1: 74438357082; Supplier Part Number 1: 732-11205-1-ND; Supplier 1: Digi-Key; Mounting Type: SMD; Package/Footprint: SMD
LED3 LED4 = LED_GREEN_0805: LED GREEN DIFFUSED 0805 SMD; Manufacturer 1: OSRAM; Forward Voltage Drop: 2.2V; Package/Footprint: 0805; Supplier Part Number 1: 475-1410-1-ND; Supplier 1: Digi-Key; Mounting Type: SMD
R6 R9 R11 R12 = RES_10kΩ_0603_1%: as R33 on sheet STM32 MCU; Supplier Part Number 1: RNCP0603FTD10K0CT-ND; Supplier 1: Digi-Key; Mounting Type: SMD; Package: 0603
R8 = RES_73.2kΩ_0603_1%: RES 73.2K OHM 1% 1/16W 0603; Manufacturer 1: TE Connectivity Passive Product; Manufacturer Part Number 1: CPF0603F73K2C1; Supplier Part Number 1: A102314CT-ND; Supplier 1: Digi-Key
R10 = RES_57.6kΩ_0603_1%: RES 57.6K OHM 1% 1/10W 0603; Manufacturer 1: YAGEO; Manufacturer Part Number 1: RC0603FR-0757K6L; Package/Footprint: 0603; Supplier 1: Digi-Key; Supplier Part Number 1: 311-57.6KHRCT-ND
R13 = RES_20.5kΩ_0603_1%: RES SMD 20.5K OHM 1% 1/10W 0603; Manufacturer 1: Panasonic Electronic Components; Manufacturer Part Number 1: ERJ-3EKF2052V; Supplier 1: Digikey; Supplier Part Number 1: P2.05KHCT-ND
R14 R15 = RES_1.2kΩ_0603_1%: RES 1.2K OHM 1% 1/10W 0603; Manufacturer 1: Yageo; Manufacturer Part Number 1: RC0603FR-071K2L; Supplier Part Number 1: 311-1.20KHRCT-ND; Supplier 1: Digi-Key; Package: 0603
R39 = RES_71.5kΩ_0603_1%: RES 71.5K OHM 1% 1/10W 0603; Manufacturer 1: Stackpole Electronics Inc; Manufacturer Part Number 1: RMCF0603FT71K5; Package/Footprint: 0603; Mounting Type: SMD; Supplier 1: Digi-Key; Supplier Part Number 1: RMCF0603FT71K5CT-ND
R40 = RES_24.9kΩ_0603_1%: RES 24.9K OHM 1% 1/10W 0603; Manufacturer 1: YAGEO; Manufacturer Part Number 1: RC0603FR-0724K9L; Supplier Part Number 1: 311-24.9KHRCT-ND; Supplier 1: Digi-Key
TP1 TP2 TP8 = TESTPOINT_KEYSTONE_LOOP: as TP24 on sheet Top; Supplier 1: Digi-Key; Mounting Type: SMD; Supplier Part Number 1: 36-5019CT-ND
U3 = TPS61023DRLR: IC REG BOOST ADJ 3A SOT563; Manufacturer 1: Texas Instruments; Package/Footprint: SOT-563; Manufacturer Part Number 1: TPS61023DRLR; Supplier 1: Digikey; Supplier Part Number 1: 296-TPS61023DRLRCT-ND
U4 = TPS62933DRLR: IC REG BUCK ADJ 3A SOT583; Manufacturer 1: Texas Instruments; Package/Footprint: SOT-583; Manufacturer Part Number 1: TPS62933DRLR; Supplier 1: Digikey; Supplier Part Number 1: 296-TPS62933DRLRCT-ND

## Sheet Lithium Battery UVP Switch.SchDoc
size A4; Organization: TESLA Motors, INC; Address1: 3500 Deer Creek Road; Address2: Palo Alto, CA; Address4: U.S.A.; SheetNumber: 7; SheetTotal: 21
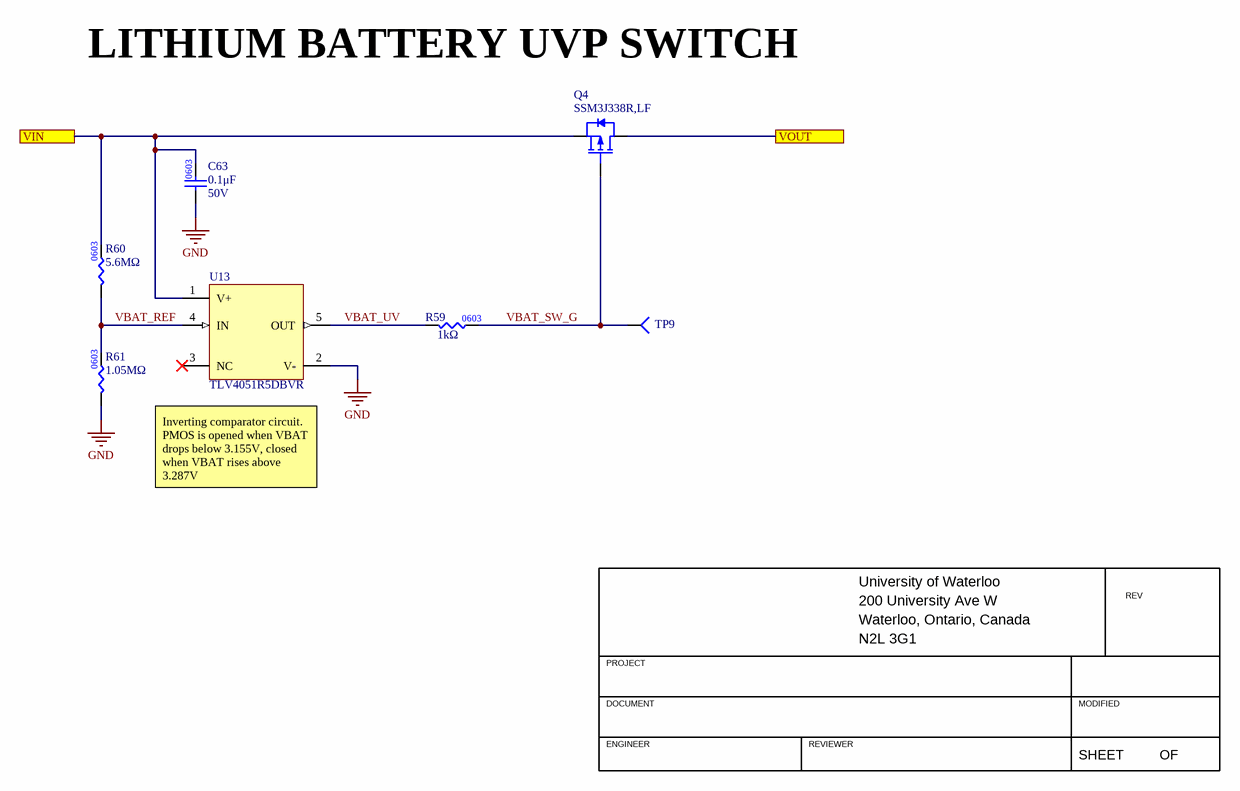
[diagram p5: Lithium Battery UVP Switch.SchDoc]

### Parts
C63  value 0.1μF  Voltage Rating: 50V  [CAP0603]  (hidden comment: CAP_0.1uF_50V_0603)
Q4  Manufacturer Part Number 1: SSM3J338R,LF  [DIO-INC_SOT23]  (hidden comment: PMOS_12V_6A)
R59  value 1kΩ  [RES0603]  (hidden comment: RES_1kΩ_0603_1%)
R60  value 5.6MΩ  [RES0603]  (hidden comment: RES_5.6MΩ_0603_1%)
R61  value 1.05MΩ  [RES0603]  (hidden comment: RES_1.05MΩ_0603_1%)
TP9  TESTPOINT_1MM_CIRCLE  [TESTPOINT_CIRCLE_1MM]  (value not drawn)  (no BOM)
U13  TLV4051R5DBVR  [TI_SOT23-5]

### Ports
VIN, VOUT

### Nets
GND: C63.1 R61.1 U13.2(V-)
VBAT_3V6: C63.2 Q4.2(Source) R60.2 U13.1(V+) ; port VIN
VBAT_DSG: Q4.3(Drain) ; port VOUT
VBAT_REF: R60.1 R61.2 U13.4(IN)
VBAT_SW_G: Q4.1(Gate) R59.2 TP9.1(=value)
VBAT_UV: R59.1 U13.5(OUT)

Not connected (* = marked no-connect by the designer): U13 3(NC)*

### Notes on the sheet
- LITHIUM BATTERY UVP SWITCH
- Inverting comparator circuit. PMOS is opened when VBAT drops below 3.155V, closed when VBAT rises above 3.287V
- University of Waterloo
- 200 University Ave W
- REV
- PROJECT
- Waterloo, Ontario, Canada
- N2L 3G1
- DOCUMENT
- ENGINEER
- REVIEWER
- MODIFIED
- SHEET
- OF

### Library data of the parts
C63 = CAP_0.1uF_50V_0603: as C8 on sheet System Voltage Regulators; Supplier Part Number 1: 311-1344-1-ND; Supplier 1: Digi-Key; Mounting Type: SMD; Dielectric: X7R
Q4 = PMOS_12V_6A: MOSFET P-CH 12V 6A SOT23F; Manufacturer 1: Toshiba Semiconductor and Storage; Supplier 1: Digi-Key; Supplier Part Number 1: SSM3J338RLFCT-ND
R59 = RES_1kΩ_0603_1%: RES 1K OHM 1% 1/8W 0603; Manufacturer 1: Stackpole Electronics Inc; Manufacturer Part Number 1: RNCP0603FTD1K00; Supplier Part Number 1: RNCP0603FTD1K00CT-ND; Supplier 1: Digi-Key; Mounting Type: SMD; Package: 0603
R60 = RES_5.6MΩ_0603_1%: RES SMD 5.6M OHM 1% 1/10W 0603; Manufacturer 1: Vishay Dale; Manufacturer Part Number 1: CRCW06035M60FKEA; Supplier 1: Digi-Key; Supplier Part Number 1: 541-5.60MHCT-ND; Tolerance: 1%; Package: 0603
R61 = RES_1.05MΩ_0603_1%: RES SMD 1.05M OHM 1% 1/10W 0603; Manufacturer 1: Stackpole Electronics Inc; Manufacturer Part Number 1: RMCF0603FT1M05; Supplier Part Number 1: RMCF0603FT1M05CT-ND; Supplier 1: Digi-Key; Mounting Type: SMD; Package: 0603
TP9 = TESTPOINT_1MM_CIRCLE: TESTPOINT 1MM CIRCLE
U13 = TLV4051R5DBVR: IC COMPARATOR 1 VOL REF SOT23-5; Manufacturer 1: Texas Instruments; Supplier 1: Digi-Key; Supplier Part Number 1: 296-TLV4051R5DBVRCT-ND; Manufacturer Part Number 1: TLV4051R5DBVR

## Sheet Lithium Battery Charger.SchDoc
size A4; Organization: TESLA Motors, INC; Address1: 3500 Deer Creek Road; Address2: Palo Alto, CA; Address4: U.S.A.; SheetNumber: 5; SheetTotal: 21
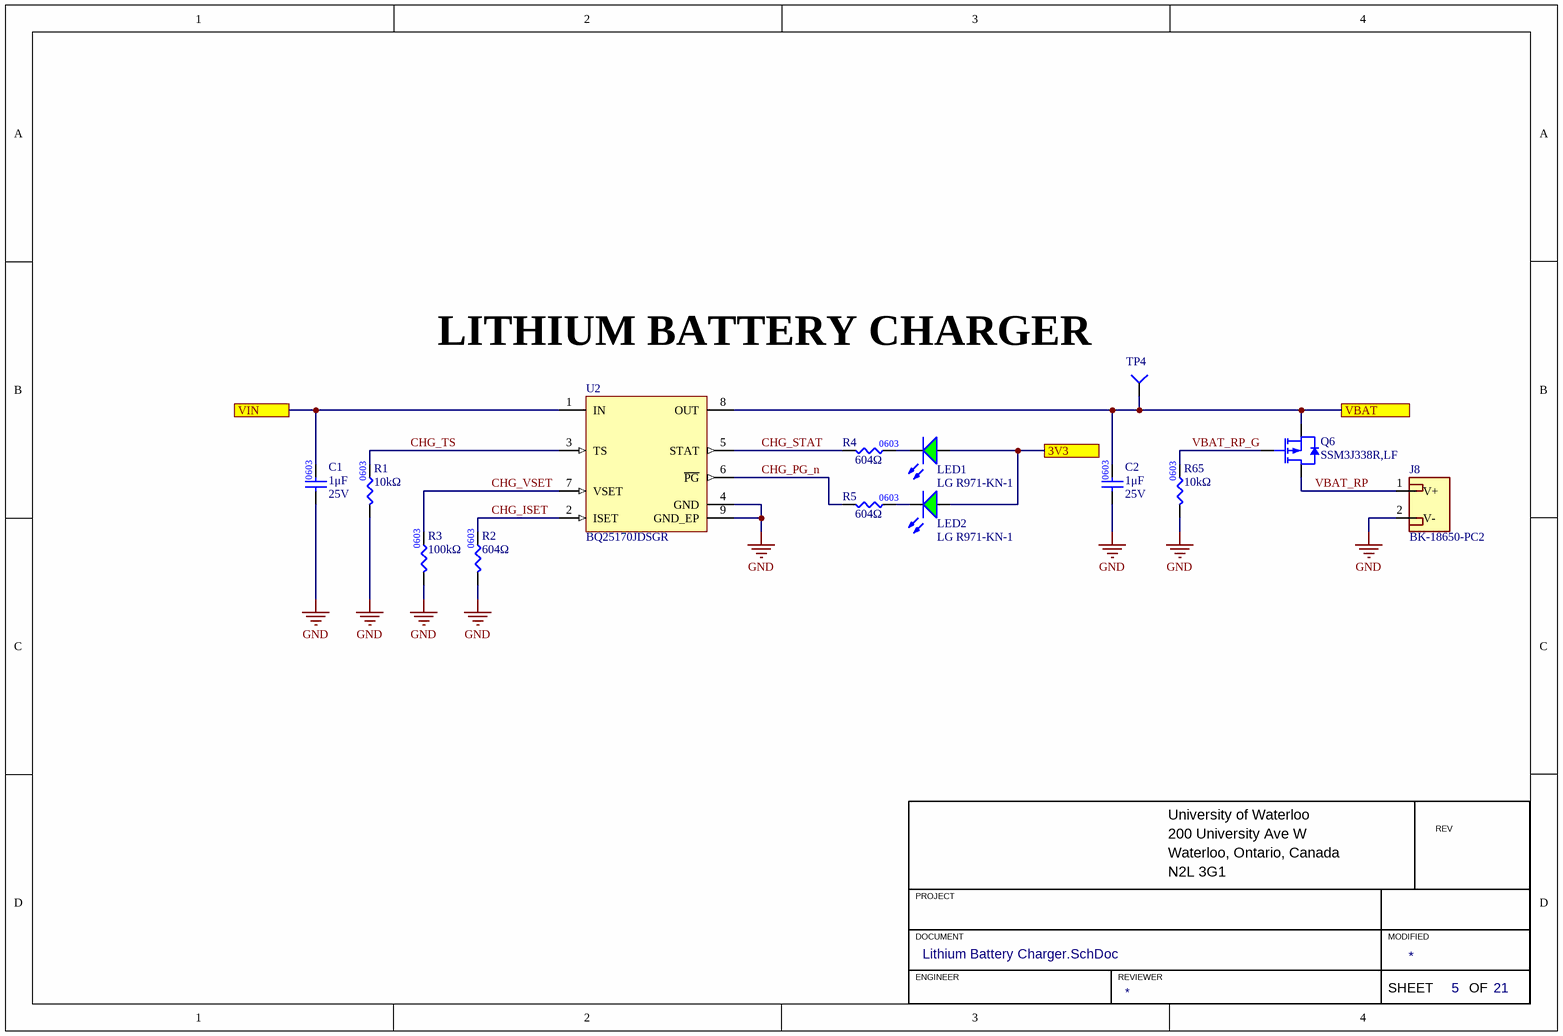
[diagram p6: Lithium Battery Charger.SchDoc]

### Parts
C1  value 1μF  Voltage Rating: 25V  [CAP0603]  (hidden comment: CAP_1uF_25V_0603)
C2  value 1μF  Voltage Rating: 25V  [CAP0603]  (hidden comment: CAP_1uF_25V_0603)
J8  Manufacturer Part Number 1: BK-18650-PC2  [MPD_18650-PC2]  (hidden comment: CON_2POS_XT90)
LED1  Manufacturer Part Number 1: LG R971-KN-1  [LED_0805_GREEN]  (hidden comment: LED_GREEN_0805)
LED2  Manufacturer Part Number 1: LG R971-KN-1  [LED_0805_GREEN]  (hidden comment: LED_GREEN_0805)
Q6  Manufacturer Part Number 1: SSM3J338R,LF  [DIO-INC_SOT23]  (hidden comment: PMOS_12V_6A)
R1  value 10kΩ  [RES0603]  (hidden comment: RES_10kΩ_0603_1%)
R2  value 604Ω  [RES0603]  (hidden comment: RES_604Ω_0603_1%)
R3  value 100kΩ  [RES0603]  (hidden comment: RES_100kΩ_0603_1%)
R4  value 604Ω  [RES0603]  (hidden comment: RES_604Ω_0603_1%)
R5  value 604Ω  [RES0603]  (hidden comment: RES_604Ω_0603_1%)
R65  value 10kΩ  [RES0603]  (hidden comment: RES_10kΩ_0603_1%)
TP4  TESTPOINT_KEYSTONE_LOOP  [KEYSTONE_5019]  (value not drawn)
U2  BQ25170JDSGR  [TI_8-WSON]

### Ports
3V3, VBAT, VIN

### Nets
3V3: LED1.1(A) LED2.1(A) ; port 3V3
5V4: C1.2 U2.1(IN) ; port VIN
GND: C1.1 C2.1 J8.2(V-) R1.1 R2.1 R3.1 R65.1 U2.4(GND) U2.9(GND_EP)
VBAT_3V6: C2.2 Q6.2(Source) TP4.1(=value) U2.8(OUT) ; port VBAT
CHG_ISET: R2.2 U2.2(ISET)
CHG_PG_n: R5.1 U2.6(~{PG})
CHG_STAT: R4.1 U2.5(STAT)
CHG_TS: R1.2 U2.3(TS)
CHG_VSET: R3.2 U2.7(VSET)
VBAT_RP: J8.1(V+) Q6.3(Drain)
VBAT_RP_G: Q6.1(Gate) R65.2
NetLED1_2: LED1.2(K) R4.2
NetLED2_2: LED2.2(K) R5.2

### Notes on the sheet
- LITHIUM BATTERY CHARGER
- University of Waterloo
- 200 University Ave W
- REV
- PROJECT
- Waterloo, Ontario, Canada
- N2L 3G1
- DOCUMENT
- ENGINEER
- REVIEWER
- MODIFIED
- SHEET
- OF
- (in symbol RES_100kΩ_0603_1%) 0603
- (in symbol RES_604Ω_0603_1%) 0603

### Library data of the parts
C1 C2 = CAP_1uF_25V_0603: CAP CER 1UF 25V X5R 0603; Manufacturer 1: Samsung; Manufacturer Part Number 1: CL10A105KA8NNNC; Supplier 1: Digi-Key; Mounting Type: SMD; Package: 0603; Supplier Part Number 1: 1276-1102-1-ND; Dielectric: X5R
J8 = CON_2POS_18650: BATTERY HOLDER 18650 PC PIN; Manufacturer 1: MPD (Memory Protection Devices); Mounting Type: TH; Supplier 1: Digi-Key; Supplier Part Number 1: BK-18650-PC2-ND
LED1 LED2 = LED_GREEN_0805: as LED3 on sheet System Voltage Regulators; Supplier Part Number 1: 475-1410-1-ND; Supplier 1: Digi-Key; Mounting Type: SMD
Q6 = PMOS_12V_6A: as Q4 on sheet Lithium Battery UVP Switch; Supplier 1: Digi-Key; Supplier Part Number 1: SSM3J338RLFCT-ND
R1 R65 = RES_10kΩ_0603_1%: as R33 on sheet STM32 MCU; Supplier Part Number 1: RNCP0603FTD10K0CT-ND; Supplier 1: Digi-Key; Mounting Type: SMD; Package: 0603
R2 R4 R5 = RES_604Ω_0603_1%: as R54 on sheet MCU Power Clock Debug; Supplier Part Number 1: 311-604HRCT-ND; Supplier 1: Digi-Key
R3 = RES_100kΩ_0603_1%: RES 100K OHM 1% 1/10W 0603; Manufacturer 1: Yageo; Manufacturer Part Number 1: RC0603FR-07100KL; Supplier Part Number 1: 311-100KHRCT-ND; Supplier 1: Digi-Key
TP4 = TESTPOINT_KEYSTONE_LOOP: as TP24 on sheet Top; Supplier 1: Digi-Key; Mounting Type: SMD; Supplier Part Number 1: 36-5019CT-ND
U2 = BQ25170JDSGR: IC BATTERY MANAGEMENT; Manufacturer 1: Texas Instruments; Package/Footprint: 8-WFDFN; Supplier 1: Digi-Key; Supplier Part Number 1: 296-BQ25170JDSGRCT-ND; Manufacturer Part Number 1: BQ25170JDSGR

## Sheet BC-MPR Interface.SchDoc
size A4; Organization: TESLA Motors, INC; Address1: 3500 Deer Creek Road; Address2: Palo Alto, CA; Address4: U.S.A.; SheetNumber: 7; SheetTotal: 13
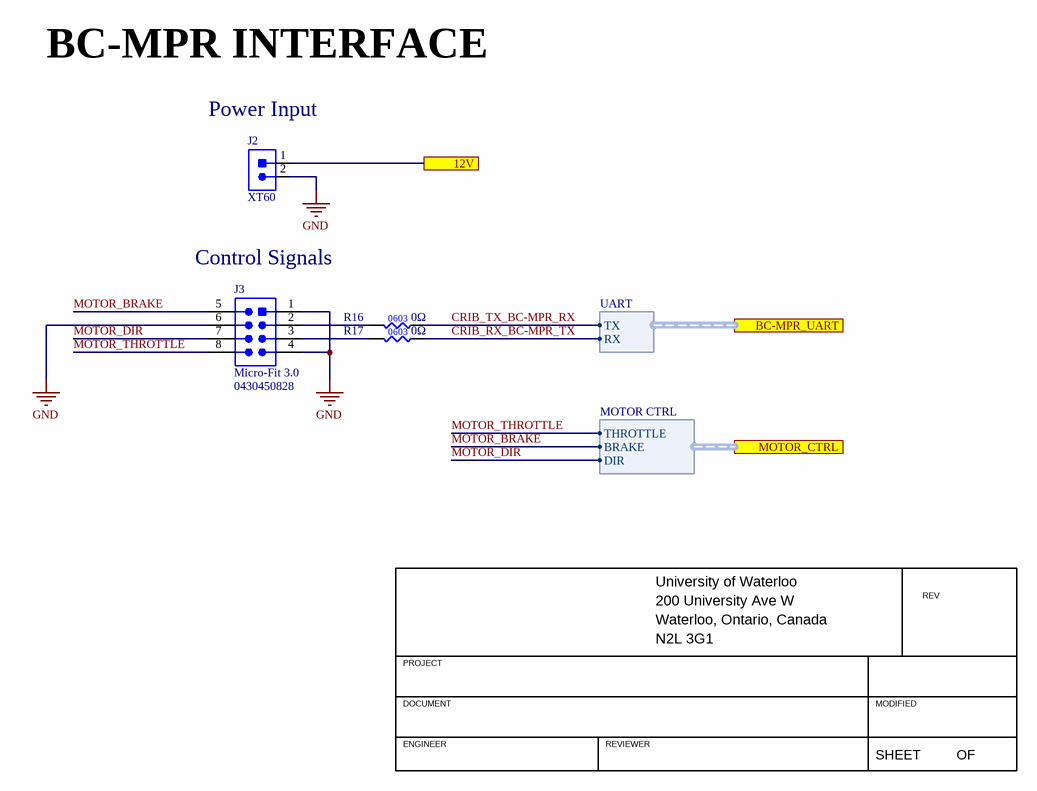
[diagram p7: BC-MPR Interface.SchDoc]

### Parts
J2  CON_2POS_XT60  [XT60]  (value not drawn)
J3  Family: Micro-Fit 3.0  [MOLEX-0430450828]  (hidden comment: 0430450828)
R16  value 0Ω  [RES0603]  (hidden comment: RES_0Ω_0603)
R17  value 0Ω  [RES0603]  (hidden comment: RES_0Ω_0603)

### Ports
12V (see Top[1A]), BC-MPR_UART (harness UART, see Top[1A], STM32 MCU[1A]), MOTOR_CTRL (harness MOTOR CTRL, see Top[1A], STM32 MCU[1A])

### Harnesses
UART: TX, RX
MOTOR CTRL: THROTTLE, BRAKE, DIR

### Nets
12V: J2.1 ; port 12V
GND: J2.2 J3.1 J3.4 J3.6
CRIB_RX_BC-MPR_TX: R17.1 ; port BC-MPR_UART.RX  [project net BC-MPR_UART.RX]
CRIB_TX_BC-MPR_RX: R16.1 ; port BC-MPR_UART.TX  [project net BC-MPR_UART.TX]
MOTOR_BRAKE: J3.5 ; port MOTOR_CTRL.BRAKE
MOTOR_DIR: J3.7 ; port MOTOR_CTRL.DIR
MOTOR_THROTTLE: J3.8 ; port MOTOR_CTRL.THROTTLE
NetJ3_2: J3.2 R16.2
NetJ3_3: J3.3 R17.2

### Notes on the sheet
- BC-MPR INTERFACE
- (near J2) Power Input
- Control Signals
- University of Waterloo
- 200 University Ave W
- REV
- PROJECT
- Waterloo, Ontario, Canada
- N2L 3G1
- DOCUMENT
- ENGINEER
- REVIEWER
- MODIFIED
- SHEET
- OF

### Library data of the parts
J2 = CON_2POS_XT60: XT60 CONNECTORS MALE/FEMALE PAIR; Manufacturer 1: SparkFun Electronics; Manufacturer Part Number 1: PRT-10474; Mounting Type: TH; Package/Footprint: XT60; Supplier 1: Digi-Key; Supplier Part Number 1: 1568-1816-ND
J3 = CON_MOLEX-HDR_4x2_TH: CONN HEADER VERT 8POS 3MM; Manufacturer 1: Molex; Voltage Rating: 250VAC; Current Rating: 5A; Pitch: 3mm; Supplier 1: Digi-Key; Supplier Part Number 1: WM10693-ND; Manufacturer Part Number 1: 0430450828
R16 R17 = RES_0Ω_0603: RES 0 OHM JUMPER 1/10W 0603; Manufacturer 1: Yageo; Manufacturer Part Number 1: RC0603JR-070RL; Supplier Part Number 1: 311-0.0GRCT-ND; Supplier 1: Digi-Key; Mounting Type: SMD; Package: 0603

## Sheet OR Power Switch.SchDoc
size A4; Organization: TESLA Motors, INC; Address1: 3500 Deer Creek Road; Address2: Palo Alto, CA; Address4: U.S.A.; SheetNumber: 9; SheetTotal: 21
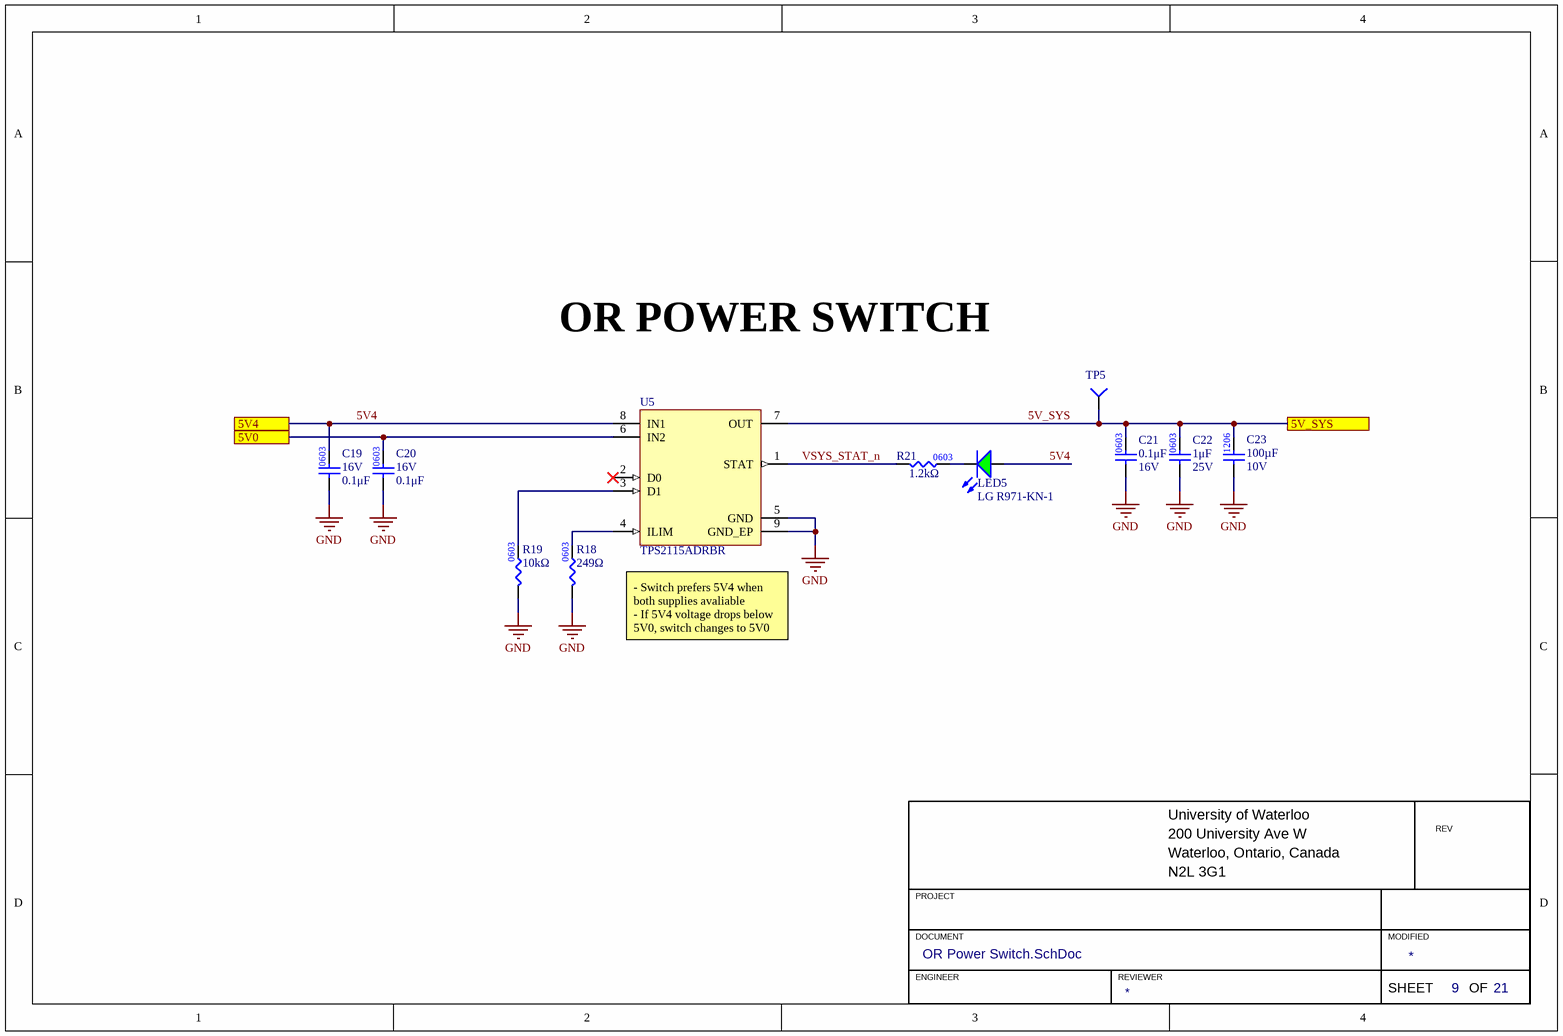
[diagram p8: OR Power Switch.SchDoc]

### Parts
C19  value 0.1μF  Voltage Rating: 16V  [CAP0603]  (hidden comment: CAP_0.1uF_16V_0603)
C20  value 0.1μF  Voltage Rating: 16V  [CAP0603]  (hidden comment: CAP_0.1uF_16V_0603)
C21  value 0.1μF  Voltage Rating: 16V  [CAP0603]  (hidden comment: CAP_0.1uF_16V_0603)
C22  value 1μF  Voltage Rating: 25V  [CAP0603]  (hidden comment: CAP_1uF_25V_0603)
C23  value 100µF  Voltage Rating: 10V  [CAP1206]  (hidden comment: CAP_100uF_10V_0603)
LED5  Manufacturer Part Number 1: LG R971-KN-1  [LED_0805_GREEN]  (hidden comment: LED_GREEN_0805)
R18  value 249Ω  [RES0603]  (hidden comment: RES_249Ω_0603_1%)
R19  value 10kΩ  [RES0603]  (hidden comment: RES_10kΩ_0603_1%)
R21  value 1.2kΩ  [RES0603]  (hidden comment: RES_1.2kΩ_0603_1%)
TP5  TESTPOINT_KEYSTONE_LOOP  [KEYSTONE_5019]  (value not drawn)
U5  TPS2115ADRBR  [TI_8-VSON]

### Ports
5V0, 5V4, 5V_SYS

### Nets
5V0: C20.2 U5.6(IN2) ; port 5V0
5V4: C19.2 LED5.1(A) U5.8(IN1) ; port 5V4
5V_SYS: C21.2 C22.2 C23.2 TP5.1(=value) U5.7(OUT) ; port 5V_SYS
GND: C19.1 C20.1 C21.1 C22.1 C23.1 R18.1 R19.1 U5.5(GND) U5.9(GND_EP)
VSYS_STAT_n: R21.1 U5.1(STAT)
NetLED5_2: LED5.2(K) R21.2
NetR18_2: R18.2 U5.4(ILIM)
NetR19_2: R19.2 U5.3(D1)

Not connected (* = marked no-connect by the designer): U5 2(D0)*

### Notes on the sheet
- OR POWER SWITCH
- - Switch prefers 5V4 when both supplies avaliable
  - If 5V4 voltage drops below 5V0, switch changes to 5V0
- University of Waterloo
- 200 University Ave W
- REV
- PROJECT
- Waterloo, Ontario, Canada
- N2L 3G1
- DOCUMENT
- ENGINEER
- REVIEWER
- MODIFIED
- SHEET
- OF
- (in symbol RES_249Ω_0603_1%) 0603

### Library data of the parts
C19-C21 = CAP_0.1uF_16V_0603: as C44 on sheet MCU Power Clock Debug; Package: 0603; Supplier Part Number 1: 311-1088-1-ND; Supplier 1: Digi-Key; Dielectric: X7R
C22 = CAP_1uF_25V_0603: as C1 on sheet Lithium Battery Charger; Supplier 1: Digi-Key; Mounting Type: SMD; Package: 0603; Supplier Part Number 1: 1276-1102-1-ND; Dielectric: X5R
C23 = CAP_100uF_10V_0603: CAP CER 100UF 10V X5R 1206; Manufacturer 1: Murata Electronics; Manufacturer Part Number 1: GRM31CR61A107MEA8L; Package/Footprint: 1206; Mounting Type: SMD; Dielectric: X5R; Supplier 1: Digi-Key; Supplier Part Number 1: 490-GRM31CR61A107MEA8LCT-ND
LED5 = LED_GREEN_0805: as LED3 on sheet System Voltage Regulators; Supplier Part Number 1: 475-1410-1-ND; Supplier 1: Digi-Key; Mounting Type: SMD
R18 = RES_249Ω_0603_1%: RES 249 OHM 1% 1/10W 0603; Manufacturer 1: YAGEO; Manufacturer Part Number 1: RC0603FR-07249RL; Supplier Part Number 1: 311-249HRCT-ND; Supplier 1: Digi-Key
R19 = RES_10kΩ_0603_1%: as R33 on sheet STM32 MCU; Supplier Part Number 1: RNCP0603FTD10K0CT-ND; Supplier 1: Digi-Key; Mounting Type: SMD; Package: 0603
R21 = RES_1.2kΩ_0603_1%: as R14 on sheet System Voltage Regulators; Supplier Part Number 1: 311-1.20KHRCT-ND; Supplier 1: Digi-Key; Package: 0603
TP5 = TESTPOINT_KEYSTONE_LOOP: as TP24 on sheet Top; Supplier 1: Digi-Key; Mounting Type: SMD; Supplier Part Number 1: 36-5019CT-ND
U5 = TPS2115ADRBR: IC OR CTRLR SRC SELECT 8SON; Manufacturer 1: Texas Instruments; Package/Footprint: 8-VDFN; Manufacturer Part Number 1: TPS2115ADRBR; Supplier 1: Digikey; Supplier Part Number 1: 296-23394-1-ND

## Sheet Auxiliary Regulators.SchDoc
size A4; Organization: TESLA Motors, INC; Address1: 3500 Deer Creek Road; Address2: Palo Alto, CA; Address4: U.S.A.; SheetNumber: 10; SheetTotal: 21
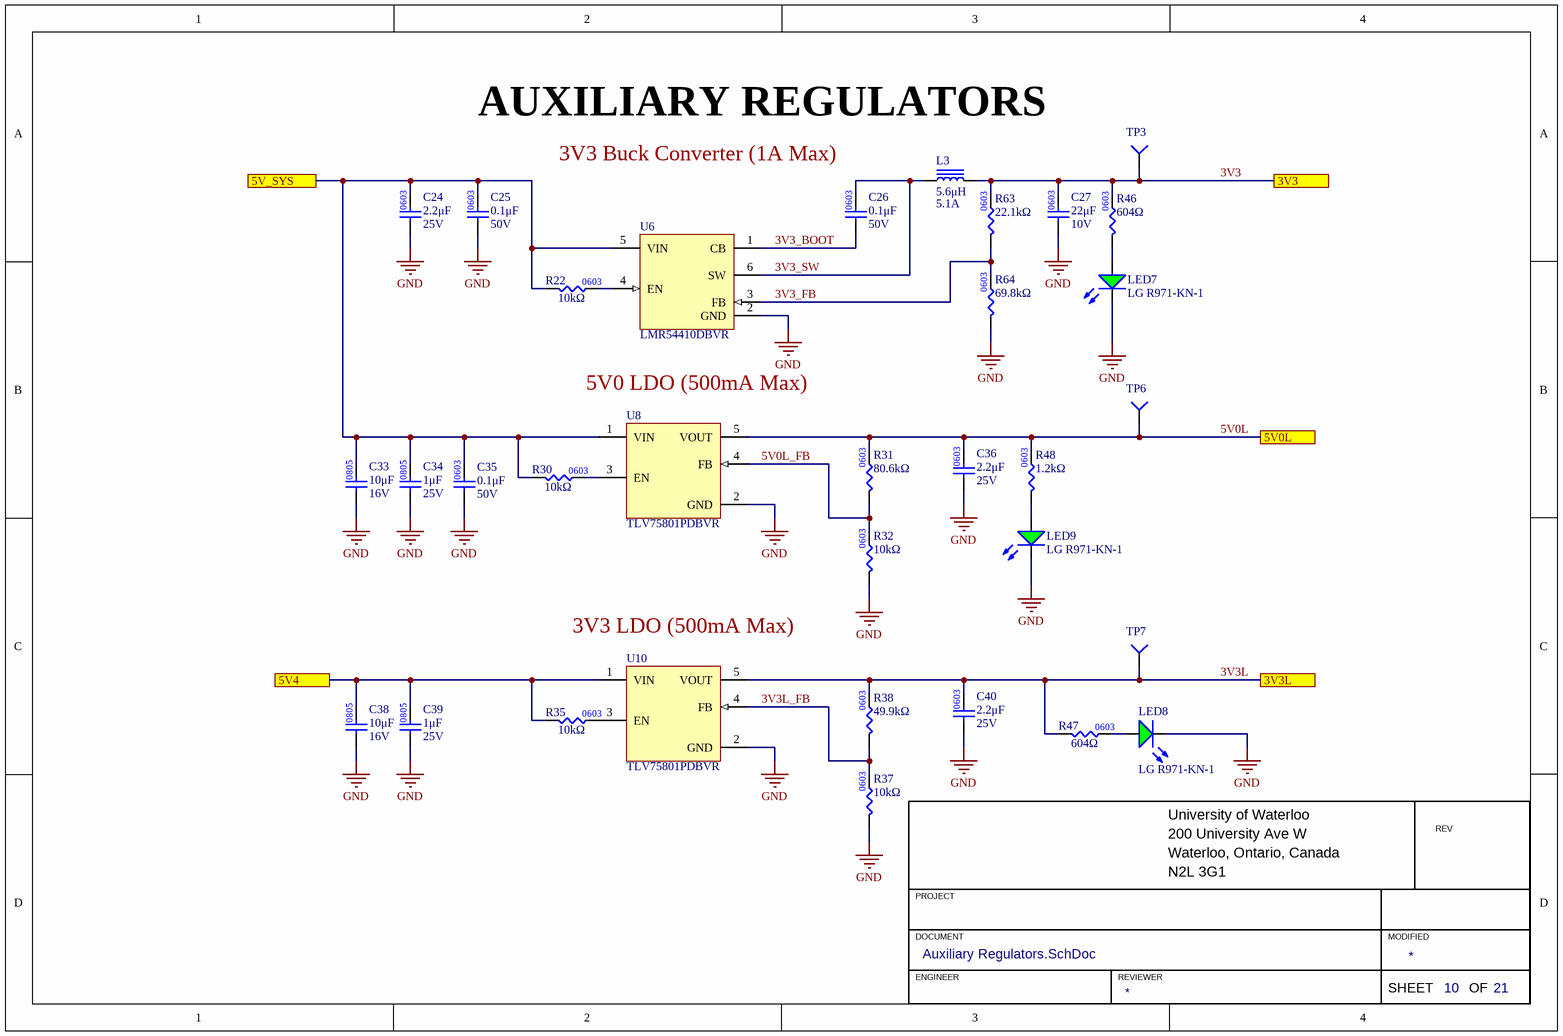
[diagram p9: Auxiliary Regulators.SchDoc]

### Parts
C24  value 2.2μF  Voltage Rating: 25V  [CAP0603]  (hidden comment: CAP_2.2uF_25V_0603)
C25  value 0.1μF  Voltage Rating: 50V  [CAP0603]  (hidden comment: CAP_0.1uF_50V_0603)
C26  value 0.1μF  Voltage Rating: 50V  [CAP0603]  (hidden comment: CAP_0.1uF_50V_0603)
C27  value 22μF  Voltage Rating: 10V  [CAP0603]  (hidden comment: CAP_22uF_10V_0603)
C33  value 10μF  Voltage Rating: 16V  [CAP0805]  (hidden comment: CAP_10uF_16V_0805)
C34  value 1μF  Voltage Rating: 25V  [CAP0805]  (hidden comment: CAP_1uF_25V_0805)
C35  value 0.1μF  Voltage Rating: 50V  [CAP0603]  (hidden comment: CAP_0.1uF_50V_0603)
C36  value 2.2μF  Voltage Rating: 25V  [CAP0603]  (hidden comment: CAP_2.2uF_25V_0603)
C38  value 10μF  Voltage Rating: 16V  [CAP0805]  (hidden comment: CAP_10uF_16V_0805)
C39  value 1μF  Voltage Rating: 25V  [CAP0805]  (hidden comment: CAP_1uF_25V_0805)
C40  value 2.2μF  Voltage Rating: 25V  [CAP0603]  (hidden comment: CAP_2.2uF_25V_0603)
L3  Current Rating: 5.1A  Inductance: 5.6μH  [IND_WURTH_4040]  (hidden comment: IND_5.6uH_5.1A)
LED7  Manufacturer Part Number 1: LG R971-KN-1  [LED_0805_GREEN]  (hidden comment: LED_GREEN)
LED8  Manufacturer Part Number 1: LG R971-KN-1  [LED_0805_GREEN]  (hidden comment: LED_GREEN)
LED9  Manufacturer Part Number 1: LG R971-KN-1  [LED_0805_GREEN]  (hidden comment: LED_GREEN)
R22  value 10kΩ  [RES0603]  (hidden comment: RES_10kΩ_0603_1%)
R30  value 10kΩ  [RES0603]  (hidden comment: RES_10kΩ_0603_1%)
R31  value 80.6kΩ  [RES0603]  (hidden comment: RES_80.6kΩ_0603_1%)
R32  value 10kΩ  [RES0603]  (hidden comment: RES_10kΩ_0603_1%)
R35  value 10kΩ  [RES0603]  (hidden comment: RES_10kΩ_0603_1%)
R37  value 10kΩ  [RES0603]  (hidden comment: RES_10kΩ_0603_1%)
R38  value 49.9kΩ  [RES0603]  (hidden comment: RES_49.9kΩ_0603_1%)
R46  value 604Ω  [RES0603]  (hidden comment: RES_604Ω_0603_1%)
R47  value 604Ω  [RES0603]  (hidden comment: RES_604Ω_0603_1%)
R48  value 1.2kΩ  [RES0603]  (hidden comment: RES_1.2kΩ_0603_1%)
R63  value 22.1kΩ  [RES0603]  (hidden comment: RES_22.1kΩ_0603_1%)
R64  value 69.8kΩ  [RES0603]  (hidden comment: RES_69.8kΩ_0603_1%)
TP3  TESTPOINT_KEYSTONE_LOOP  [KEYSTONE_5019]  (value not drawn)
TP6  TESTPOINT_KEYSTONE_LOOP  [KEYSTONE_5019]  (value not drawn)
TP7  TESTPOINT_KEYSTONE_LOOP  [KEYSTONE_5019]  (value not drawn)
U6  LMR54410DBVR  [SOT23-6]
U8  TLV75801PDBVR  [TI_SOT23-5]
U10  TLV75801PDBVR  [TI_SOT23-5]

### Ports
3V3 (see Top[1C], Lithium Battery Charger[3B], SD Card Interface[2B]), 3V3L (see Top[1C], Real Time Clock[1B]), 5V0L (see Top[1C], Throttle Interfaces[2B]), 5V4 (see Top[1C], OR Power Switch[1B], System Voltage Regulators[4B]), 5V_SYS (see Top[1C], OR Power Switch[4B], TFT Display Interface[2C])

### Nets
3V3: C27.2 L3.2 R46.2 R63.2 TP3.1(=value) ; port 3V3
3V3L: C40.2 R38.2 R47.1 TP7.1(=value) U10.5(VOUT) ; port 3V3L
5V0L: C36.2 R31.2 R48.2 TP6.1(=value) U8.5(VOUT) ; port 5V0L
5V4: C38.2 C39.2 R35.1 U10.1(VIN) ; port 5V4
5V_SYS: C24.2 C25.2 C33.2 C34.2 C35.2 R22.1 R30.1 U6.5(VIN) U8.1(VIN) ; port 5V_SYS
GND: C24.1 C25.1 C27.1 C33.1 C34.1 C35.1 C36.1 C38.1 C39.1 C40.1 LED7.2(K) LED8.2(K) LED9.2(K) R32.1 R37.1 R64.1 U6.2(GND) U8.2(GND) U10.2(GND)
3V3_BOOT: C26.1 U6.1(CB)
3V3_FB: R63.1 R64.2 U6.3(FB)
3V3_SW: C26.2 L3.1 U6.6(SW)
3V3L_FB: R37.2 R38.1 U10.4(FB)
5V0L_FB: R31.1 R32.2 U8.4(FB)
NetLED7_1: LED7.1(A) R46.1
NetLED8_1: LED8.1(A) R47.2
NetLED9_1: LED9.1(A) R48.1
NetR22_2: R22.2 U6.4(EN)
NetR30_2: R30.2 U8.3(EN)
NetR35_2: R35.2 U10.3(EN)

### Notes on the sheet
- AUXILIARY REGULATORS
- (near C26) 3V3 Buck Converter (1A Max)
- 5V0 LDO (500mA Max)
- (near U10) 3V3 LDO (500mA Max)
- University of Waterloo
- 200 University Ave W
- REV
- PROJECT
- Waterloo, Ontario, Canada
- N2L 3G1
- DOCUMENT
- ENGINEER
- REVIEWER
- MODIFIED
- SHEET
- OF
- (in symbol CAP_1uF_25V_0805) 0805
- (in symbol CAP_2.2uF_25V_0603) 0603
- (in symbol RES_22.1kΩ_0603_1%) 0603
- (in symbol RES_49.9kΩ_0603_1%) 0603
- (in symbol RES_80.6kΩ_0603_1%) 0603
- (in symbol RES_604Ω_0603_1%) 0603

### Library data of the parts
C24 C36 C40 = CAP_2.2uF_25V_0603: as C64 on sheet MCU Power Clock Debug; Supplier Part Number 1: 445-5964-1-ND; Supplier 1: Digi-Key
C25 C26 C35 = CAP_0.1uF_50V_0603: as C8 on sheet System Voltage Regulators; Supplier Part Number 1: 311-1344-1-ND; Supplier 1: Digi-Key; Mounting Type: SMD; Dielectric: X7R
C27 = CAP_22uF_10V_0603: CAP CER 22UF 10V X5R 0603; Manufacturer: Taiyo Yuden; Manufacturer Part Number: LMK107BBJ226MA-T; Supplier 1: Digi-Key; Supplier Part Number 1: 587-4913-1-ND; Package: 0603
C33 C38 = CAP_10uF_16V_0805: as C4 on sheet System Voltage Regulators; Supplier 1: Digi-Key; Supplier Part Number 1: 311-1865-1-ND; Mounting Type: SMD; Dielectric: X5R
C34 C39 = CAP_1uF_25V_0805: as C17 on sheet System Voltage Regulators; Supplier 1: Digi-Key; Supplier Part Number 1: 490-4785-1-ND; Dielectric: X7R
L3 = IND_5.6uH_5.1A: POWER INDUCTOR 4040; 5.6 H; 5.1A; Manufacturer 1: Würth Elektronik; Manufacturer Part Number 1: 74439325056; DC Resistance (DCR): 44.4mOhm; Inductance Tolerance: 20%; Saturation Current: 5.5A; Supplier Part Number 1: 732-74439325056CT-ND; Supplier 1: Digi-Key; Mounting Type: SMD
LED7-LED9 = LED_GREEN: as LED6 on sheet MCU Power Clock Debug; Supplier Part Number 1: 475-1410-1-ND; Supplier 1: Digi-Key; Mounting Type: SMD
R22 R30 R32 R35 R37 = RES_10kΩ_0603_1%: as R33 on sheet STM32 MCU; Supplier Part Number 1: RNCP0603FTD10K0CT-ND; Supplier 1: Digi-Key; Mounting Type: SMD; Package: 0603
R31 = RES_80.6kΩ_0603_1%: RES 80.6K OHM 1% 1/10W 0603; Manufacturer 1: Stackpole Electronics Inc; Manufacturer Part Number 1: RMCF0603FT80K6; Supplier Part Number 1: RMCF0603FT80K6CT-ND; Supplier 1: Digi-Key
R38 = RES_49.9kΩ_0603_1%: RES 49.9K OHM 1% 1/10W 0603; Manufacturer 1: KOA Speer Electronics, Inc.; Manufacturer Part Number 1: RK73H1JTTD4992F; Supplier Part Number 1: 2019-RK73H1JTTD4992FCT-ND; Supplier 1: Digi-Key; Mounting Type: SMD
R46 R47 = RES_604Ω_0603_1%: as R54 on sheet MCU Power Clock Debug; Supplier Part Number 1: 311-604HRCT-ND; Supplier 1: Digi-Key
R48 = RES_1.2kΩ_0603_1%: as R14 on sheet System Voltage Regulators; Supplier Part Number 1: 311-1.20KHRCT-ND; Supplier 1: Digi-Key; Package: 0603
R63 = RES_22.1kΩ_0603_1%: RES 22.1K OHM 1% 1/10W 0603; Manufacturer 1: Stackpole Electronics Inc; Manufacturer Part Number 1: RMCF0603FT22K1; Supplier 1: Digi-Key; Supplier Part Number 1: RMCF0603FT22K1CT-ND
R64 = RES_69.8kΩ_0603_1%: RES 69.8K OHM 1% 1/10W 0603; Manufacturer 1: YAGEO; Manufacturer Part Number 1: RC0603FR-0769K8L; Package/Footprint: 0603; Mounting Type: SMD; Supplier 1: Digi-Key; Supplier Part Number 1: 311-69.8KHRCT-ND
TP3 TP6 TP7 = TESTPOINT_KEYSTONE_LOOP: as TP24 on sheet Top; Supplier 1: Digi-Key; Mounting Type: SMD; Supplier Part Number 1: 36-5019CT-ND
U6 = LMR54410DBVR: IC REG BUCK ADJ 1A SOT23-6; Manufacturer 1: Texas Instruments; Package/Footprint: SOT-23-6; Manufacturer Part Number 1: LMR54410DBVR; Supplier 1: Digikey; Supplier Part Number 1: 296-LMR54410DBVRCT-ND
U8 U10 = TLV75801PDBVR: IC REG LIN POS ADJ 500MA SOT23-5; Manufacturer 1: Texas Instruments; Input Voltage (Max): 6V; Package/Footprint: SOT-25; Output Current: 500mA; Operating Temperature: -40°C - 125°C; Supplier 1: Digi-Key; Supplier Part Number 1: 296-TLV75801PDBVRCT-ND; Manufacturer Part Number 1: TLV75801PDBVR